# EAGLE design unimodule (EAGLE 9.6.0)
BOARD_REV: 1a

## Sheet 1 of 4
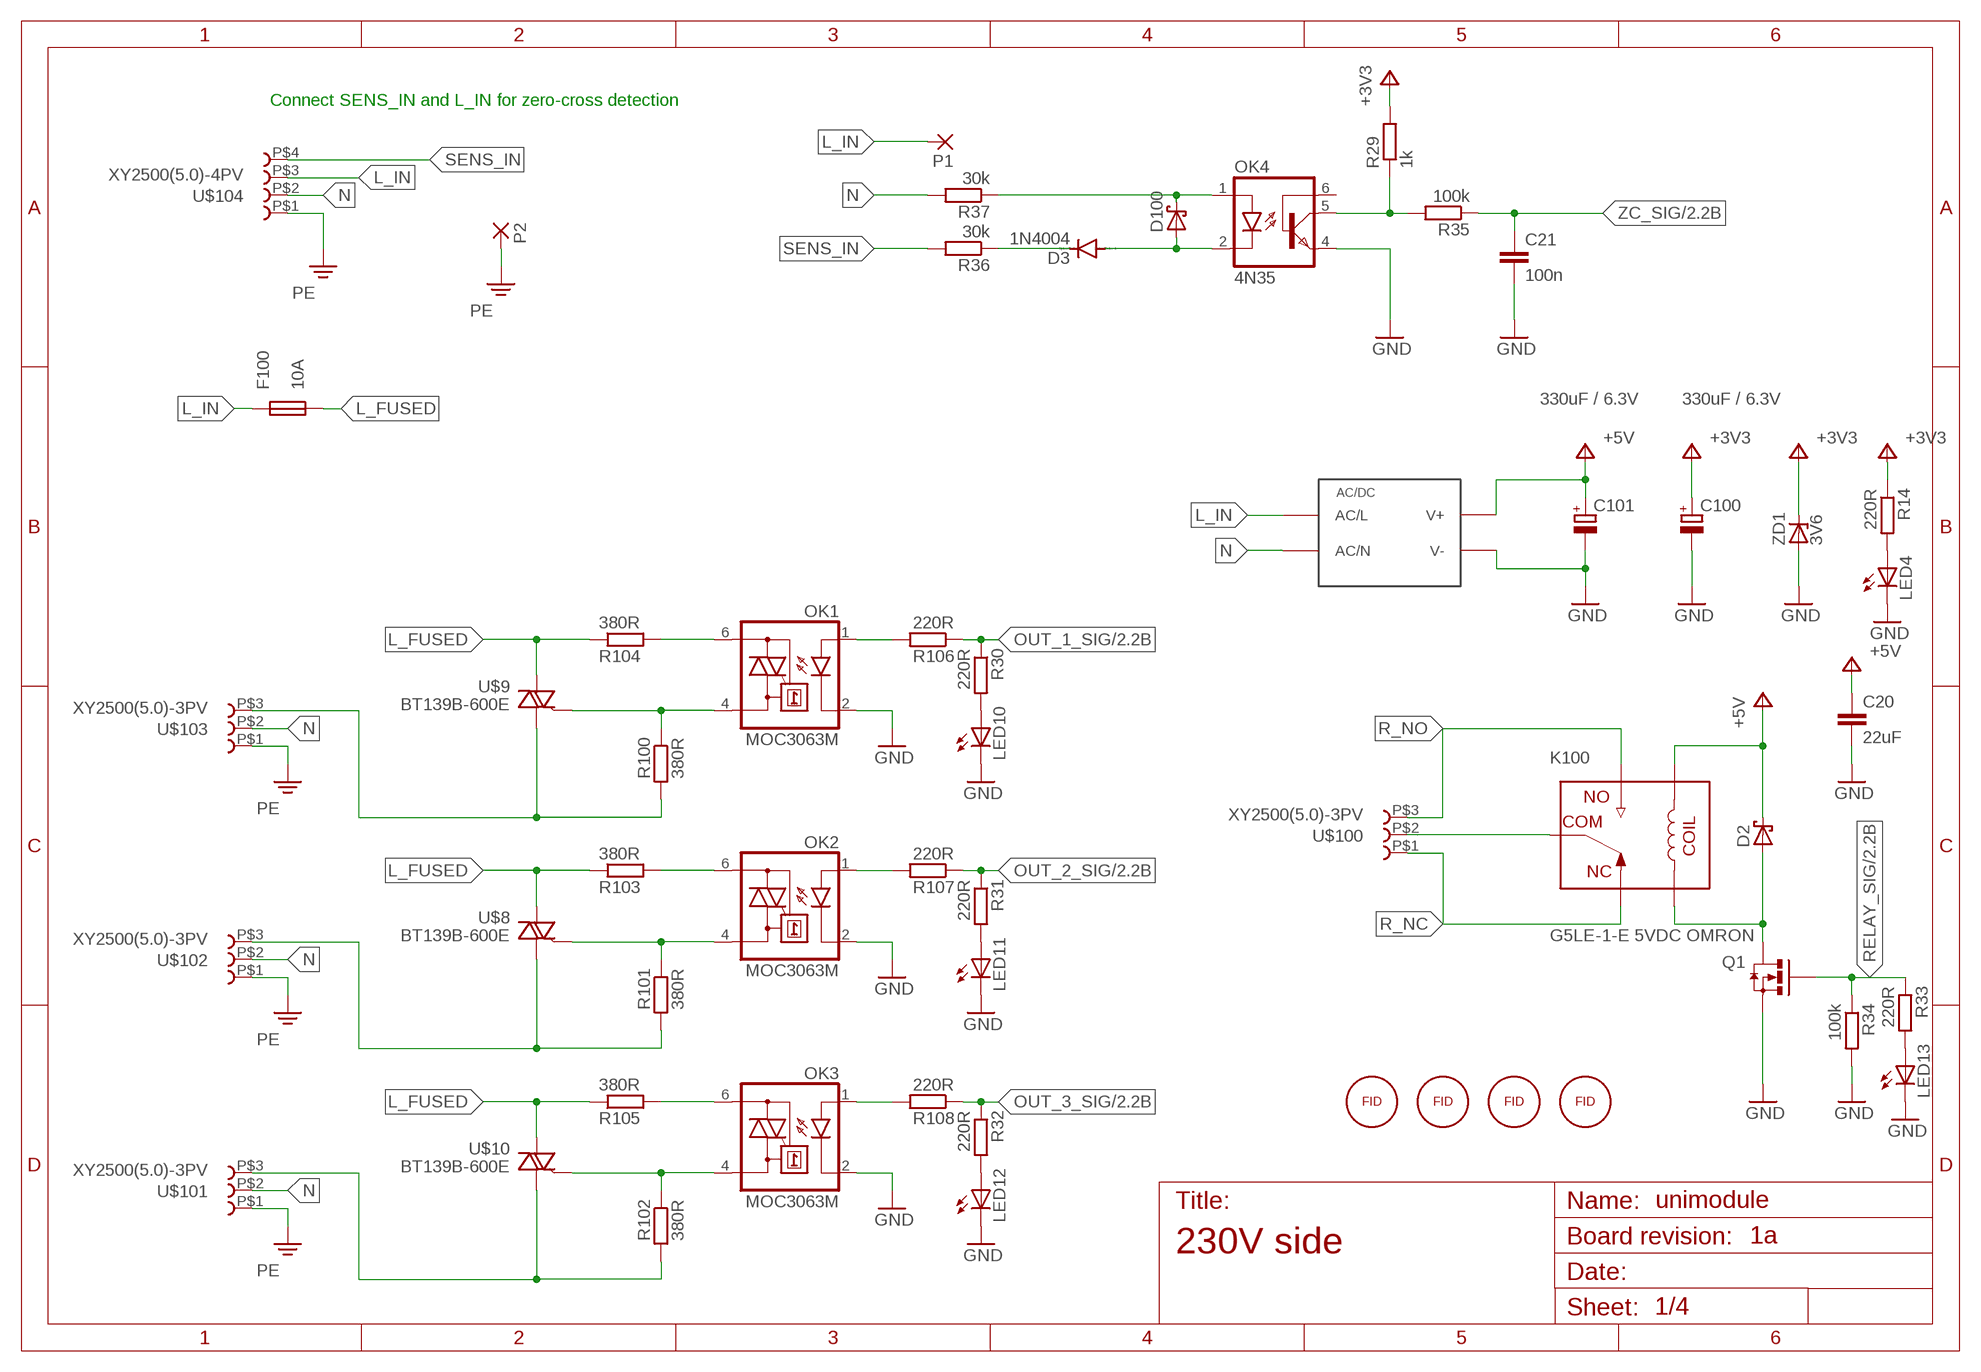
[diagram p0: schematic, sheet 1]
FRAME1 (A4L-LOC): TITLE: 230V side

### Parts
C20  22uF  C-EUC1206  [C1206]
C21  100n  C-EUC0603  [C0603]
C100  330uF / 6.3V  CPOL-EUE2.5-7  [E2,5-7]
C101  330uF / 6.3V  CPOL-EUE2.5-6  [E2,5-6]
D2  PMEG4005EH  [SOD123F]
D3  1N4004  [DO41-10]
D100  BAT46  [SOD123F]
F100  10A  FUSE20X5  [SCHURTER_0751.0056_5X20]
FD1  FIDUCIAL-MARKER2MM  [1-2MM-FIDUCIAL]
FD2  FIDUCIAL-MARKER2MM  [1-2MM-FIDUCIAL]
FD100  FIDUCIAL-MARKER2MM  [1-2MM-FIDUCIAL]
FD101  FIDUCIAL-MARKER2MM  [1-2MM-FIDUCIAL]
K100  G5LE-1-E 5VDC OMRON  JSM1-12V-5  [JSM1-12V-5]
LED4  LED0603  [LED-0603]
LED10  LED0603  [LED-0603]
LED11  LED0603  [LED-0603]
LED12  LED0603  [LED-0603]
LED13  LED0603  [LED-0603]
OK1  MOC3063M  MOC30  [DIL06]
OK2  MOC3063M  MOC30  [DIL06]
OK3  MOC3063M  MOC30  [DIL06]
OK4  4N35  [DIL06]
P1  WIRE-PAD1MM  [THT-PAD_0.5MM]
P2  WIRE-PAD3MM  [6MM2]
Q1  2N7002  [PG-SOT23]
R14  220R  R-EU_R0603  [R0603]
R29  1k  R-EU_R0603  [R0603]
R30  220R  R-EU_R0603  [R0603]
R31  220R  R-EU_R0603  [R0603]
R32  220R  R-EU_R0603  [R0603]
R33  220R  R-EU_R0603  [R0603]
R34  100k  R-EU_R0603  [R0603]
R35  100k  R-EU_R0603  [R0603]
R36  30k  R-EU_0207/10  [0207/10]
R37  30k  R-EU_0207/10  [0207/10]
R100  380R  R-EU_R1206  [R1206]
R101  380R  R-EU_R1206  [R1206]
R102  380R  R-EU_R1206  [R1206]
R103  380R  R-EU_R1206  [R1206]
R104  380R  R-EU_R1206  [R1206]
R105  380R  R-EU_R1206  [R1206]
R106  220R  R-EU_R0603  [R0603]
R107  220R  R-EU_R0603  [R0603]
R108  220R  R-EU_R0603  [R0603]
U$8  BT139B-600E  BT139B  [D2PACK]
U$9  BT139B-600E  BT139B  [D2PACK]
U$10  BT139B-600E  BT139B  [D2PACK]
U$100  XY2500(5.0)-3PV  [XY2500V-B_3P]
U$101  XY2500(5.0)-3PV  [XY2500V-B_3P]
U$102  XY2500(5.0)-3PV  [XY2500V-B_3P]
U$103  XY2500(5.0)-3PV  [XY2500V-B_3P]
U$104  XY2500(5.0)-4PV  [XY2500V-B_4P]
U$105  IRM-03-05  IRM-03  [IRM-03]
ZD1  3V6  BZD27SOD323-W  [SOD323-W]

### Nets
+3V3: C100.+ R14.1 R29.2 ZD1.C ; also sheet 2,3,4
+5V: C20.1 C101.+ D2.C K100.2 U$105.V+ ; also sheet 2,4
GND: C20.2 C21.2 C100.- C101.- LED4.C LED10.C LED11.C LED12.C LED13.C OK1.2(C) OK2.2(C) OK3.2(C) OK4.4(EMI) Q1.2(S) R34.2 U$105.V- ZD1.A ; also sheet 2,3,4
L_FUSED [HV]: F100.I_1 F100.I_2 F100.I_3 R103.1 R104.1 R105.1 U$8.2(A2) U$9.2(A2) U$10.2(A2)
L_IN [HV]: F100.O_1 F100.O_2 F100.O_3 P1.P$1(P) U$104.P$3 U$105.AC/L
L_OUT_1 [HV]: R100.2 U$9.1(A1) U$103.P$3
L_OUT_2 [HV]: R101.2 U$8.1(A1) U$102.P$3
L_OUT_3 [HV]: R102.2 U$10.1(A1) U$101.P$3
N [HV]: R37.2 U$101.P$2 U$102.P$2 U$103.P$2 U$104.P$2 U$105.AC/N
N$1 [HV]: D3.A D100.A OK4.2(C)
N$2 [HV]: D3.C R36.1
N$4 [HV]: D100.C OK4.1(A) R37.1
N$5 [HV]: OK3.6(A2) R105.2
N$6 [HV]: OK3.4(A1) R102.1 U$10.3(G)
N$7 [HV]: OK2.6(A2) R103.2
N$8: OK3.1(A) R108.2
N$9 [HV]: OK2.4(A1) R101.1 U$8.3(G)
N$10: OK2.1(A) R107.2
N$11 [HV]: OK1.6(A2) R104.2
N$12 [HV]: OK1.4(A1) R100.1 U$9.3(G)
N$13: OK1.1(A) R106.2
N$16: LED10.A R30.2
N$17: LED11.A R31.2
N$18: LED12.A R32.2
N$20: D2.A K100.5 Q1.3(D)
N$21: LED13.A R33.2
N$22: LED4.A R14.2
OUT_1_SIG: R30.1 R106.1 ; also sheet 2
OUT_2_SIG: R31.1 R107.1 ; also sheet 2
OUT_3_SIG: R32.1 R108.1 ; also sheet 2
PE [HV]: P2.P$1(P) P2.P$2(P) P2.P$5(P) P2.P$6(P) P2.P$7(P) P2.P$8(P) P2.P$9(P) P2.P$10(P) P2.P$11(P) U$101.P$1 U$102.P$1 U$103.P$1 U$104.P$1
R_C [HV]: K100.1 U$100.P$2
R_NC: K100.4 U$100.P$1
R_NO [HV]: K100.3 U$100.P$3
RELAY_SIG: Q1.1(G) R33.1 R34.1 ; also sheet 2
SENS_IN [HV]: R36.2 U$104.P$4
ZC: OK4.5(COL) R29.1 R35.2
ZC_SIG: C21.1 R35.1 ; also sheet 2
Unconnected: OK4.6(BAS)

### Notes on the sheet
- Connect SENS_IN and L_IN for zero-cross detection

## Sheet 2 of 4
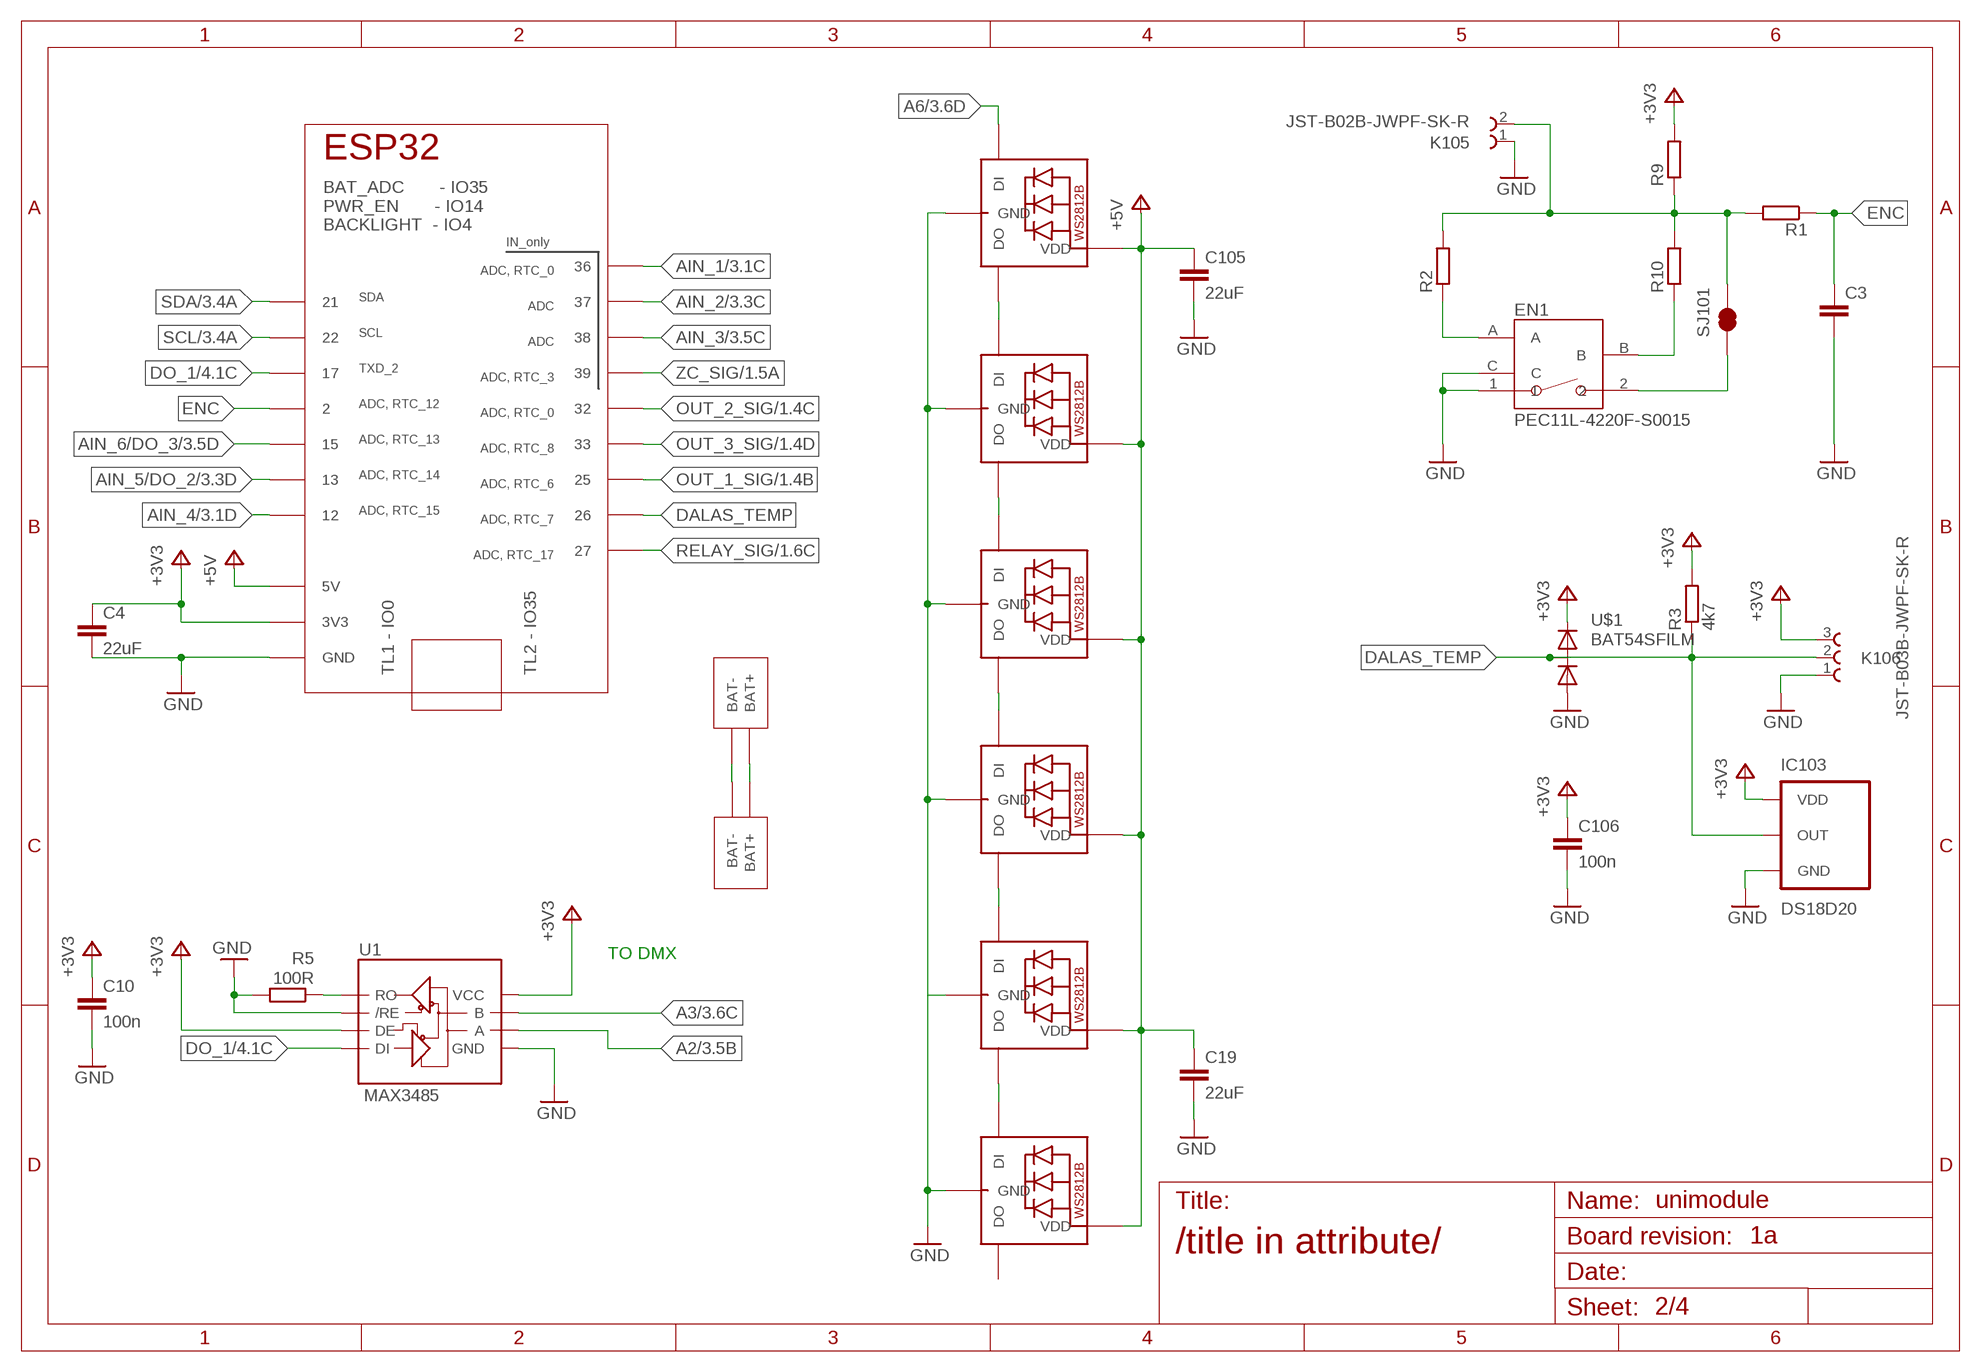
[diagram p1: schematic, sheet 2]
FRAME2 (A4L-LOC): TITLE: /title in attribute/

### Parts
C3  C-EUC0603  [C0603]
C4  22uF  C-EUC1206  [C1206]
C10  100n  C-EUC0603  [C0603]
C11  DISP_BATSMD  [BAT_SMD]
C19  22uF  C-EUC1206  [C1206]
C105  22uF  C-EUC1206  [C1206]
C106  100n  C-EUC0603  [C0603]
C107  DISP_BAT2,54  [BAT_THT_254]
EN1  PEC11L-4220F-S0015  [PEC11L-4220F-S0015]
IC1  TTGO_DISP  [TTGO_DISP_DEFAULT]
IC103  DS18D20  [TO92]
K105  JST-B02B-JWPF-SK-R  [JST-B02B-JWPF-SK-R]
K106  JST-B03B-JWPF-SK-R  [JST-B03B-JWPF-SK-R]
LED1  WS2812B5050  [WS2812B]
LED2  WS2812B5050  [WS2812B]
LED3  WS2812B5050  [WS2812B]
LED5  WS2812B5050  [WS2812B]
LED6  WS2812B5050  [WS2812B]
LED14  WS2812B5050  [WS2812B]
R1  R-EU_R0603  [R0603]
R2  R-EU_R0603  [R0603]
R3  4k7  R-EU_R0603  [R0603]
R5  100R  R-EU_R0603  [R0603]
R9  R-EU_R0603  [R0603]
R10  R-EU_R0603  [R0603]
SJ101  NET-TIE  [SMD-JUMPER-TIE]
U1  MAX3485  RS485SOIC  [SO08]
U$1  BAT54SFILM  [PG-SOT23]

### Nets
+3V3: C4.1 C10.1 C106.1 IC1.3V3_1(3V3) IC1.3V3_2(3V3) IC103.3(VDD) K106.3 R3.2 R9.2 U1.3(DE) U1.8(VCC) U$1.2(C) ; also sheet 1,3,4
+5V: C19.1 C105.1 IC1.5V LED1.1-VDD(VDD) LED2.1-VDD(VDD) LED3.1-VDD(VDD) LED5.1-VDD(VDD) LED6.1-VDD(VDD) LED14.1-VDD(VDD) ; also sheet 1,4
A2: U1.6(A) ; also sheet 3
A3: U1.7(B) ; also sheet 3
A6: LED1.4-DIN(DI) ; also sheet 3
AIN_1: IC1.36 ; also sheet 3
AIN_2: IC1.37 ; also sheet 3
AIN_3: IC1.38 ; also sheet 3
AIN_4: IC1.12 ; also sheet 3
AIN_5/DO_2: IC1.13 ; also sheet 3,4
AIN_6/DO_3: IC1.15 ; also sheet 3,4
BAT+: C11.BAT+ C107.BAT+
BAT-: C11.BAT- C107.BAT-
DALAS_TEMP: IC1.26 IC103.2(OUT) K106.2 R3.1 U$1.3(COMMON)
DO_1: IC1.17 U1.4(DI) ; also sheet 4
ENC: C3.1 IC1.2 R1.1
ENC_2: K105.2 R1.2 R2.2 R9.1 R10.2 SJ101.2
GND: C3.2 C4.2 C10.2 C19.2 C105.2 C106.2 EN1.1 EN1.C IC1.GND_1(GND) IC1.GND_2(GND) IC1.GND_3(GND) IC1.GND_4(GND) IC1.GND_5(GND) IC103.1(GND) K105.1 K106.1 LED1.3-GND(GND) LED2.3-GND(GND) LED3.3-GND(GND) LED5.3-GND(GND) LED6.3-GND(GND) LED14.3-GND(GND) R5.2 U1.2(/RE) U1.5(GND) U$1.1(A) ; also sheet 1,3,4
N$3: EN1.A R2.1
N$14: EN1.B R10.1
N$15: EN1.2 SJ101.1
N$19: LED1.2-DOUT(DO) LED2.4-DIN(DI)
N$25: LED2.2-DOUT(DO) LED3.4-DIN(DI)
N$26: LED3.2-DOUT(DO) LED5.4-DIN(DI)
N$27: LED5.2-DOUT(DO) LED6.4-DIN(DI)
N$28: LED6.2-DOUT(DO) LED14.4-DIN(DI)
N$38: R5.1 U1.1(RO)
OUT_1_SIG: IC1.25 ; also sheet 1
OUT_2_SIG: IC1.32 ; also sheet 1
OUT_3_SIG: IC1.33 ; also sheet 1
RELAY_SIG: IC1.27 ; also sheet 1
SCL: IC1.22 ; also sheet 3
SDA: IC1.21 ; also sheet 3
ZC_SIG: IC1.39 ; also sheet 1
Unconnected: LED14.2-DOUT(DO)

### Notes on the sheet
- TO DMX

## Sheet 3 of 4
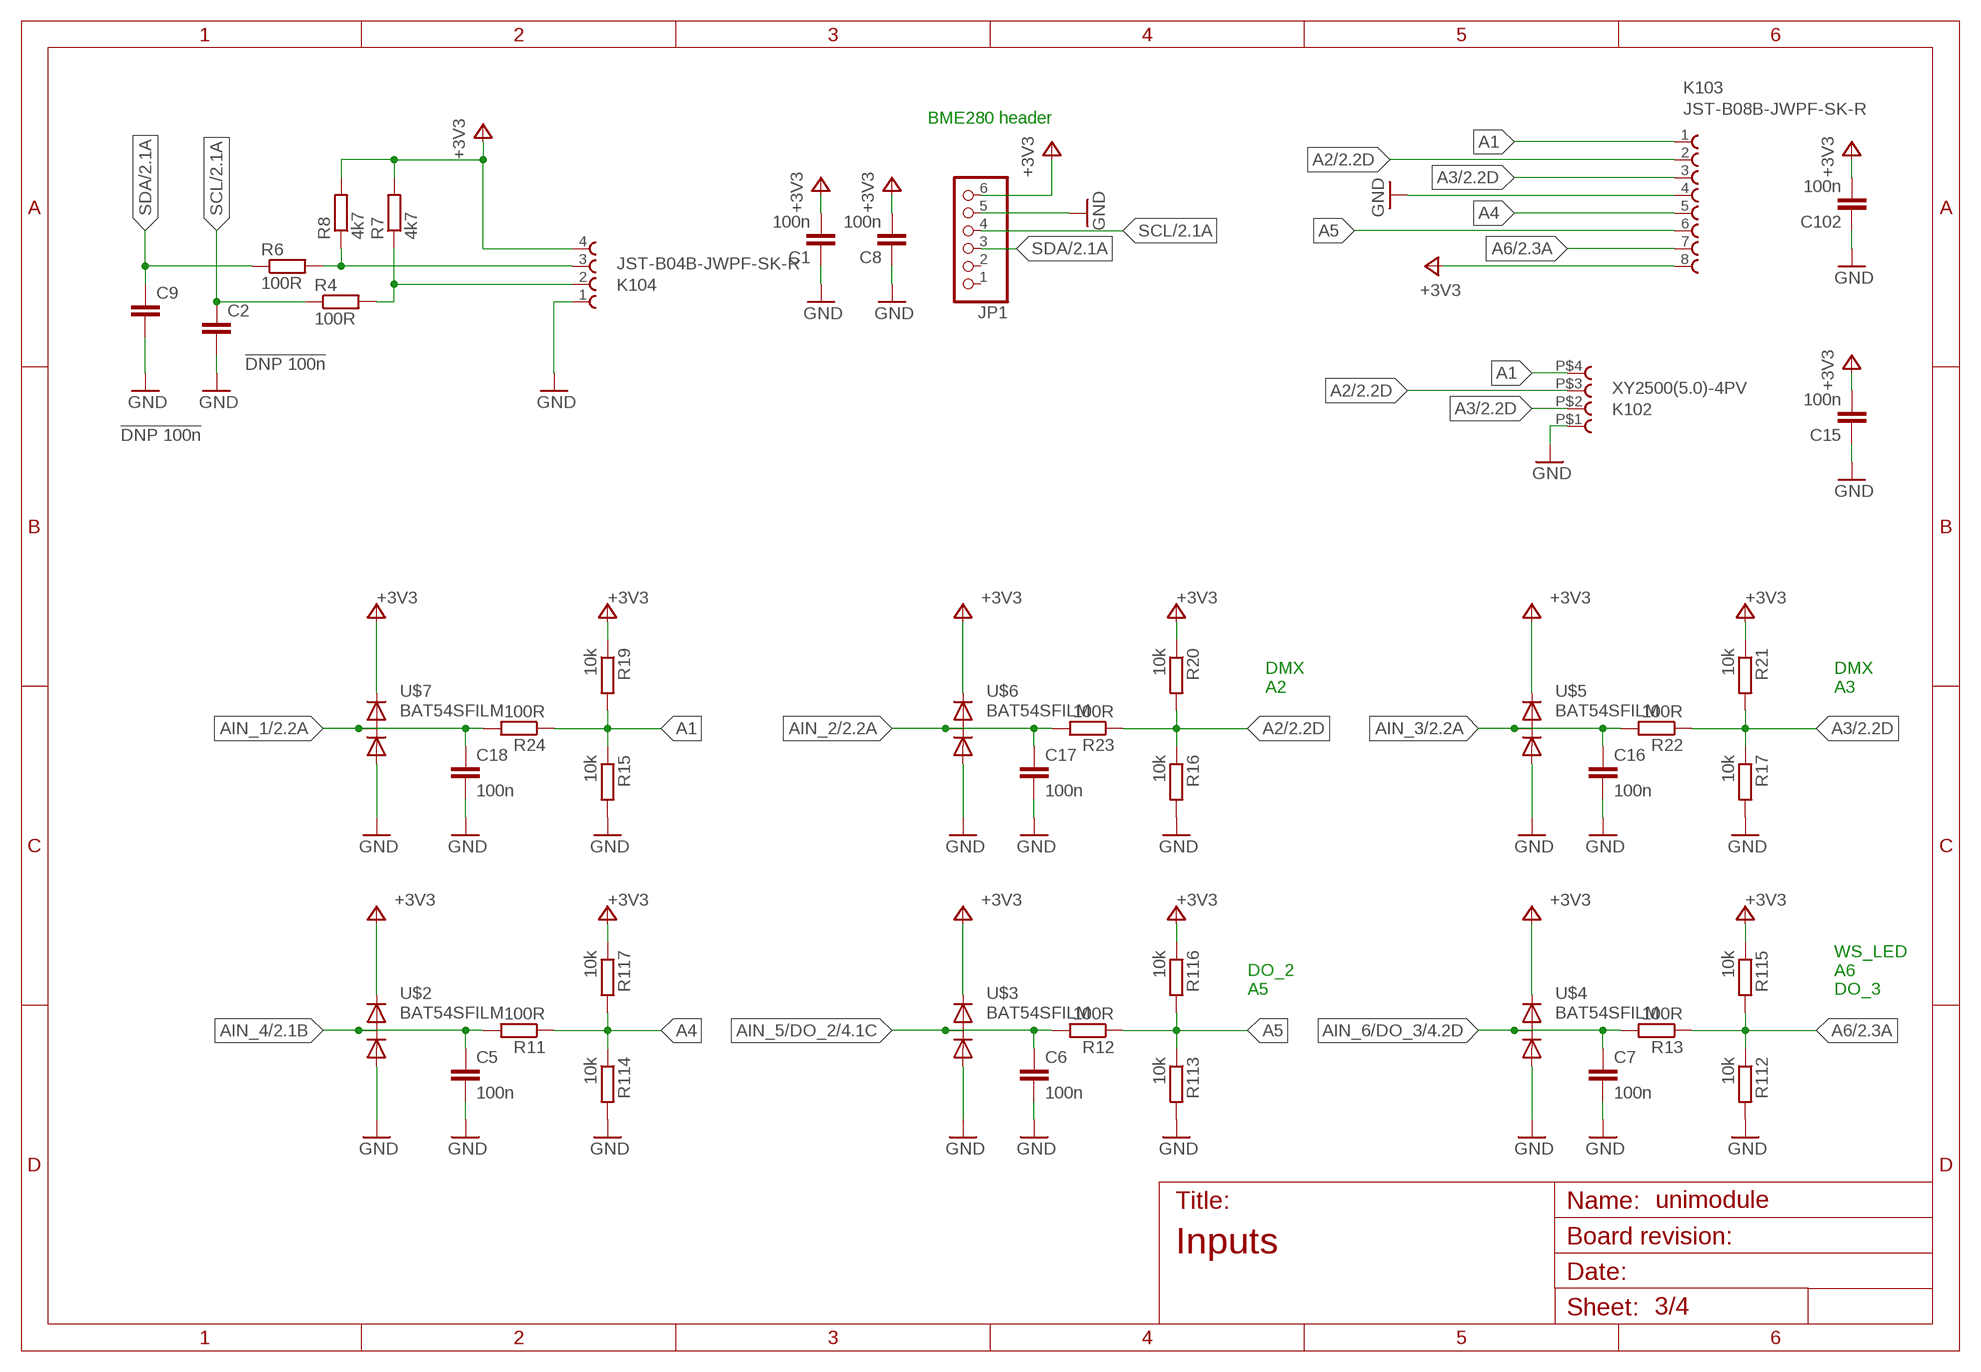
[diagram p2: schematic, sheet 3]
FRAME3 (A4L-LOC): TITLE: Inputs

### Parts
C1  100n  C-EUC0603  [C0603]
C2  !DNP 100n  C-EUC0603  [C0603]
C5  100n  C-EUC0603  [C0603]
C6  100n  C-EUC0603  [C0603]
C7  100n  C-EUC0603  [C0603]
C8  100n  C-EUC0603  [C0603]
C9  !DNP 100n  C-EUC0603  [C0603]
C15  100n  C-EUC0603  [C0603]
C16  100n  C-EUC0603  [C0603]
C17  100n  C-EUC0603  [C0603]
C18  100n  C-EUC0603  [C0603]
C102  100n  C-EUC0603  [C0603]
JP1  PINHD-1X6  [1X06]
K102  XY2500(5.0)-4PV  [XY2500V-B_4P]
K103  JST-B08B-JWPF-SK-R  [JST-B08B-JWPF-SK-R]
K104  JST-B04B-JWPF-SK-R  [JST-B04B-JWPF-SK-R]
R4  100R  R-EU_R0603  [R0603]
R6  100R  R-EU_R0603  [R0603]
R7  4k7  R-EU_R0603  [R0603]
R8  4k7  R-EU_R0603  [R0603]
R11  100R  R-EU_R0603  [R0603]
R12  100R  R-EU_R0603  [R0603]
R13  100R  R-EU_R0603  [R0603]
R15  10k  R-EU_R0603  [R0603]
R16  10k  R-EU_R0603  [R0603]
R17  10k  R-EU_R0603  [R0603]
R19  10k  R-EU_R0603  [R0603]
R20  10k  R-EU_R0603  [R0603]
R21  10k  R-EU_R0603  [R0603]
R22  100R  R-EU_R0603  [R0603]
R23  100R  R-EU_R0603  [R0603]
R24  100R  R-EU_R0603  [R0603]
R112  10k  R-EU_R0603  [R0603]
R113  10k  R-EU_R0603  [R0603]
R114  10k  R-EU_R0603  [R0603]
R115  10k  R-EU_R0603  [R0603]
R116  10k  R-EU_R0603  [R0603]
R117  10k  R-EU_R0603  [R0603]
U$2  BAT54SFILM  [PG-SOT23]
U$3  BAT54SFILM  [PG-SOT23]
U$4  BAT54SFILM  [PG-SOT23]
U$5  BAT54SFILM  [PG-SOT23]
U$6  BAT54SFILM  [PG-SOT23]
U$7  BAT54SFILM  [PG-SOT23]

### Nets
+3V3: C1.2 C8.2 C15.2 C102.2 JP1.6 K103.8 K104.4 R7.2 R8.2 R19.1 R20.1 R21.1 R115.1 R116.1 R117.1 U$2.2(C) U$3.2(C) U$4.2(C) U$5.2(C) U$6.2(C) U$7.2(C) ; also sheet 1,2,4
A1: K102.P$4 K103.1 R15.1 R19.2 R24.1
A2: K102.P$3 K103.2 R16.1 R20.2 R23.1 ; also sheet 2
A3: K102.P$2 K103.3 R17.1 R21.2 R22.1 ; also sheet 2
A4: K103.5 R11.1 R114.1 R117.2
A5: K103.6 R12.1 R113.1 R116.2
A6: K103.7 R13.1 R112.1 R115.2 ; also sheet 2
AIN_1: C18.1 R24.2 U$7.3(COMMON) ; also sheet 2
AIN_2: C17.1 R23.2 U$6.3(COMMON) ; also sheet 2
AIN_3: C16.1 R22.2 U$5.3(COMMON) ; also sheet 2
AIN_4: C5.1 R11.2 U$2.3(COMMON) ; also sheet 2
AIN_5/DO_2: C6.1 R12.2 U$3.3(COMMON) ; also sheet 2,4
AIN_6/DO_3: C7.1 R13.2 U$4.3(COMMON) ; also sheet 2,4
GND: C1.1 C2.2 C5.2 C6.2 C7.2 C8.1 C9.2 C15.1 C16.2 C17.2 C18.2 C102.1 JP1.5 K102.P$1 K103.4 K104.1 R15.2 R16.2 R17.2 R112.2 R113.2 R114.2 U$2.1(A) U$3.1(A) U$4.1(A) U$5.1(A) U$6.1(A) U$7.1(A) ; also sheet 1,2,4
SCL: C2.1 JP1.4 R4.1 ; also sheet 2
SCL_P: K104.2 R4.2 R7.1
SDA: C9.1 JP1.3 R6.1 ; also sheet 2
SDA_P: K104.3 R6.2 R8.1
Unconnected: JP1.1 JP1.2

### Notes on the sheet
- BME280 header
- DMX
  A2
- DMX
  A3
- DO_2
  A5
- WS_LED
  A6
  DO_3

## Sheet 4 of 4
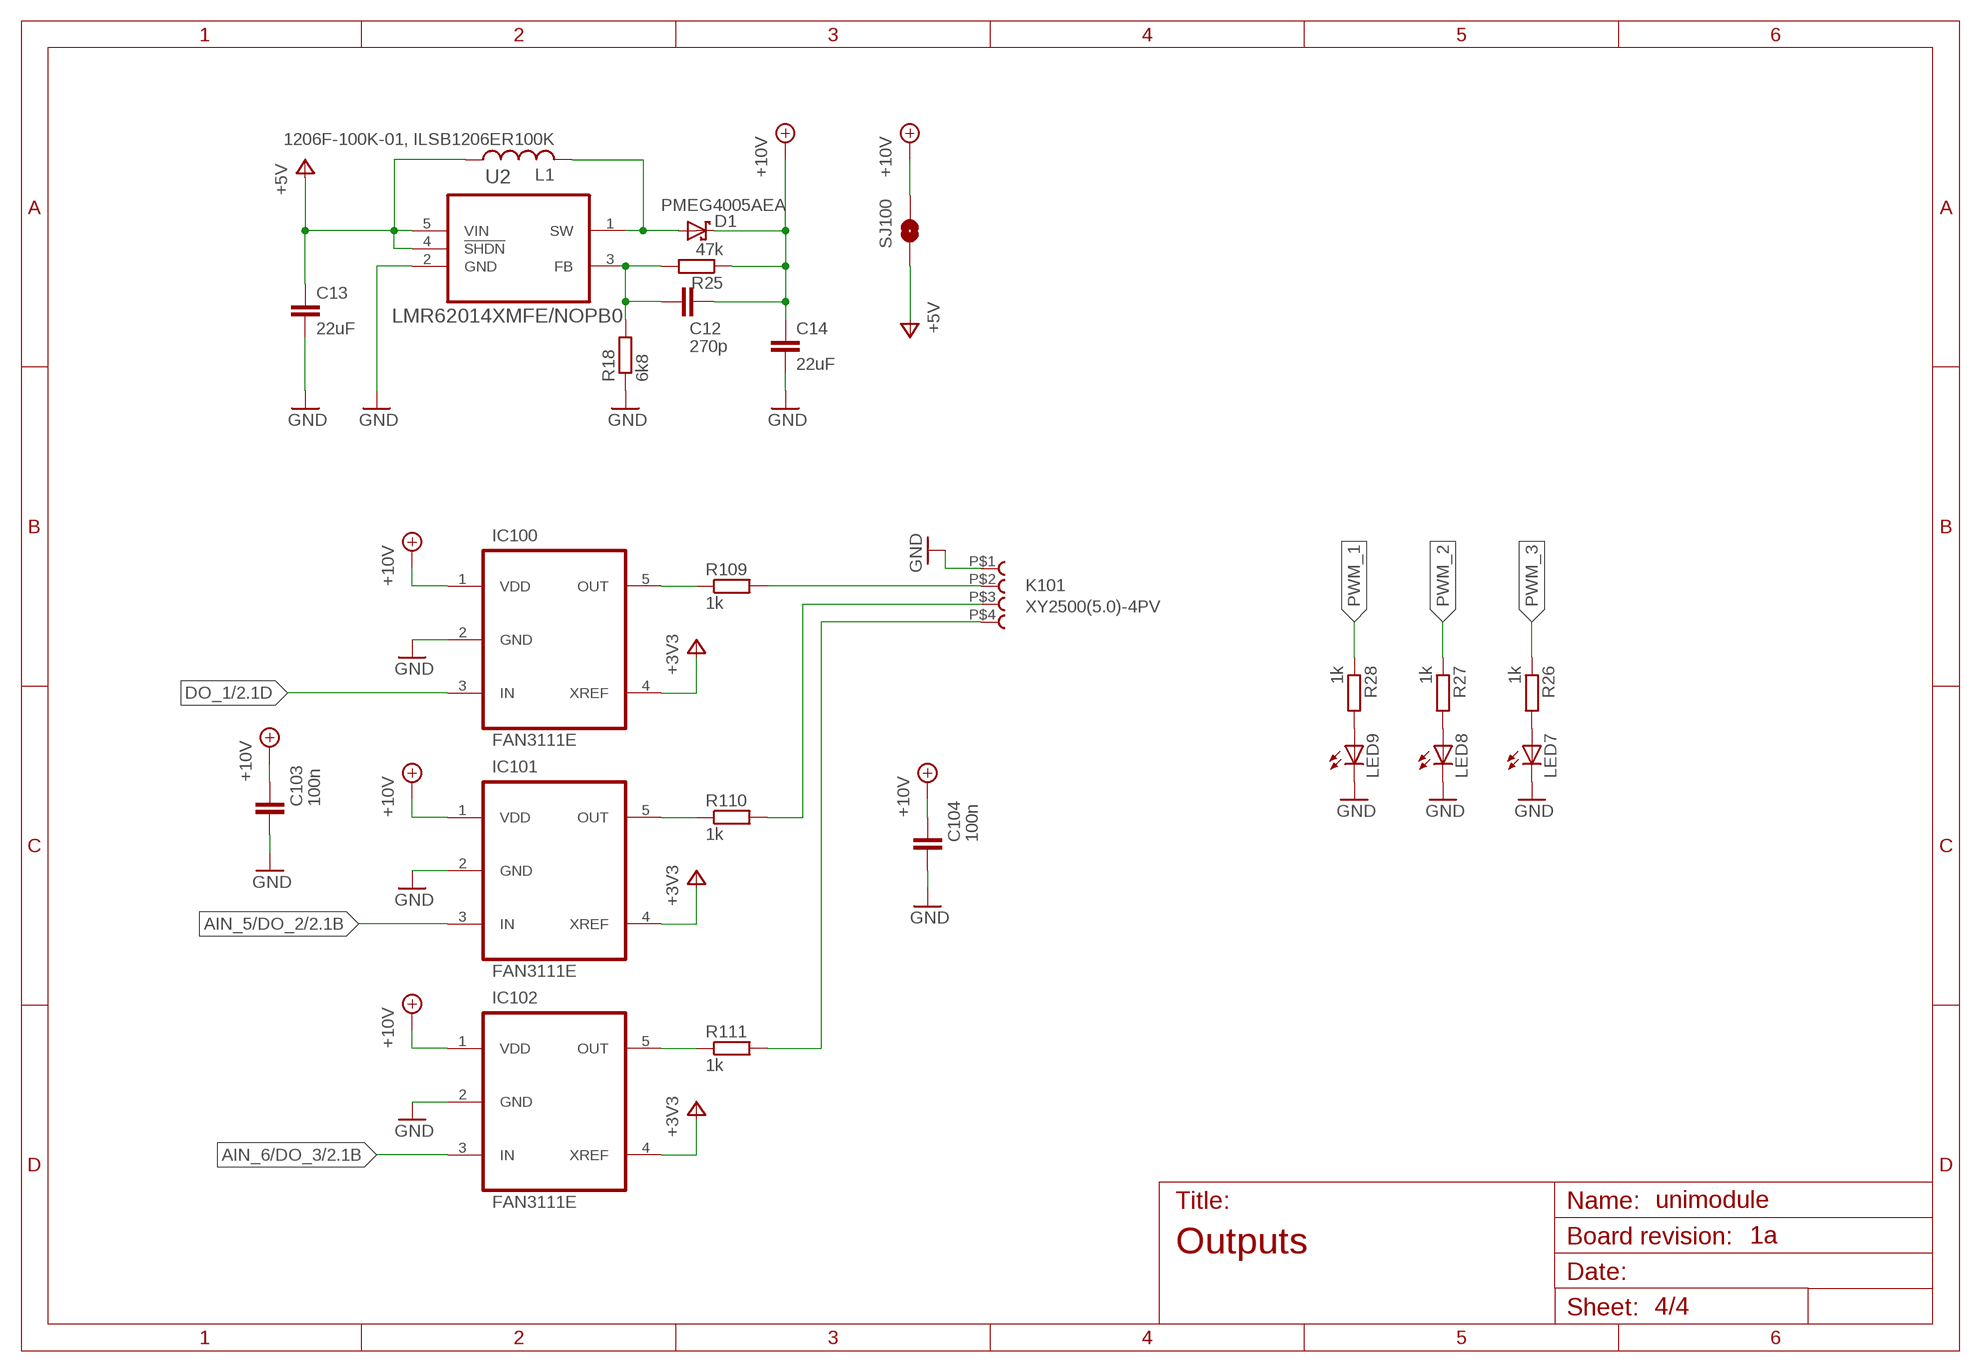
[diagram p3: schematic, sheet 4]
FRAME4 (A4L-LOC): TITLE: Outputs

### Parts
C12  270p  C-EUC0603  [C0603]
C13  22uF  C-EUC1206  [C1206]
C14  22uF  C-EUC1206  [C1206]
C103  100n  C-EUC0603  [C0603]
C104  100n  C-EUC0603  [C0603]
D1  PMEG4005AEA  PMEG4005EH  [SOD123F]
IC100  FAN3111E  [SOT23-5]
IC101  FAN3111E  [SOT23-5]
IC102  FAN3111E  [SOT23-5]
K101  XY2500(5.0)-4PV  [XY2500V-B_4P]
L1  1206F-100K-01, ILSB1206ER100K  L-US  [C3216]
LED7  LED0603  [LED-0603]
LED8  LED0603  [LED-0603]
LED9  LED0603  [LED-0603]
R18  6k8  R-EU_R0603  [R0603]
R25  47k  R-EU_R0603  [R0603]
R26  1k  R-EU_R0603  [R0603]
R27  1k  R-EU_R0603  [R0603]
R28  1k  R-EU_R0603  [R0603]
R109  1k  R-EU_R1206  [R1206]
R110  1k  R-EU_R1206  [R1206]
R111  1k  R-EU_R1206  [R1206]
SJ100  SMD-JUMPER  [SMD-JUMPER]
U2  LMR62014XMFE/NOPB0  [SOT23-5]

### Nets
+3V3: IC100.4(XREF) IC101.4(XREF) IC102.4(XREF) ; also sheet 1,2,3
+5V: C13.1 L1.1 SJ100.1 U2.4(!SHDN) U2.5(VIN) ; also sheet 1,2
+10V: C12.2 C14.1 C103.2 C104.2 D1.C IC100.1(VDD) IC101.1(VDD) IC102.1(VDD) R25.1 SJ100.2
AIN_5/DO_2: IC101.3(IN) ; also sheet 2,3
AIN_6/DO_3: IC102.3(IN) ; also sheet 2,3
DO_1: IC100.3(IN) ; also sheet 2
GND: C13.2 C14.2 C103.1 C104.1 IC100.2(GND) IC101.2(GND) IC102.2(GND) K101.P$1 LED7.C LED8.C LED9.C R18.1 U2.2(GND) ; also sheet 1,2,3
N$23: IC101.5(OUT) R110.1
N$24: D1.A L1.2 U2.1(SW)
N$29: LED9.A R28.2
N$30: LED8.A R27.2
N$31: IC100.5(OUT) R109.1
N$32: LED7.A R26.2
N$33: IC102.5(OUT) R111.1
N$34: C12.1 R18.2 R25.2 U2.3(FB)
PWM_1: K101.P$2 R28.1 R109.2
PWM_2: K101.P$3 R27.1 R110.2
PWM_3: K101.P$4 R26.1 R111.2

## Library data of the parts
C1-C10 C12-C21 C102 C105 C106 = rcl:C-EU: CAPACITOR, European symbol; SPICEPREFIX: C
C11 C107 = TTGO_LCD_DISP:DISP_BAT
C100 C101 = rcl:CPOL-EU: POLARIZED CAPACITOR, European symbol; SPICEPREFIX: C
C103 C104 = rcl:C-EU: CAPACITOR, European symbol
D1 D2 = siliXcon-semiconductors:PMEG4005; HEIGHT: 1.4
D3 = diode:1N4004: DIODE general purpose rectifier, 1 A
D100 = siliXcon-semiconductors:BAT46; HEIGHT: 1.4
EN1 = Encoders:PEC11L-4220F-S0015: ROTARY ENCODER MECHANICAL 15PPR Manufacturer's datasheet <https://www.bourns.com/docs/Product-Datasheets/PEC11L.pdf>; CREATED_BY: PCBLayout.com; DIGIKEY_PARTNO: PEC11L-4220F-S0015-ND; MANUFACTURER: Bourns Inc.; MPN: PEC11L-4220F-S0015
F100 = siliXcon-passive:FUSE; HEIGHT: 14
FD1 FD2 FD100 FD101 = siliXcon-pads:FIDUCIAL-MARKER; HEIGHT: 0.01
IC1 = TTGO_LCD_DISP:TTGO_DISP; HEIGHT: 11
IC100-IC102 = siliXcon-ICs:FAN3111E; HEIGHT: 1.4
IC103 = siliXcon-ICs:DS18D20; HEIGHT: 8
JP1 = pinhead:PINHD-1X6: PIN HEADER
K100 = Relay:JSM1-12V-5: RELAY AUTOMOTIVE SPDT 15A 12V Manufacturer's datasheet <https://media.digikey.com/pdf/Data%20Sheets/Panasonic%20Electric%20Works%20PDFs/JS-M_Series_Rev_Dec_2011.pdf>; CREATED_BY: PCBLayout.com; DIGIKEY_PARTNO: 255-1240-ND; MANUFACTURER: Panasonic Electric Works; MPN: JSM1-12V-5
K101 K102 U$104 = siliXcon-connectors:XY2500(5.0)-4P; HEIGHT: 12
K103 = siliXcon-connectors:JST-B08B-JWPF-SK-R; HEIGHT: 17
K104 = siliXcon-connectors:JST-B04B-JWPF-SK-R; HEIGHT: 17
K105 = siliXcon-connectors:JST-B02B-JWPF-SK-R; HEIGHT: 17
K106 = siliXcon-connectors:JST-B03B-JWPF-SK-R; HEIGHT: 17
L1 = rcl:L-US: INDUCTOR, American symbol
LED1-LED3 LED5 LED6 LED14 = adafruit:WS2812B
LED4 LED7-LED13 = siliXcon-semiconductors:LED; HEIGHT: 0.8
OK1-OK3 = siliXcon-ICs:MOC30: 6-Pin DIP Zero-Cross Optoisolators Triac Driver Output (250/400 Volt Peak); HEIGHT: 5
OK4 = optocoupler:4N35: MOTOROLA OPTO COUPLER; MF: FAIRCHILD SEMICONDUCTOR; MPN: 4N35; OC_FARNELL: 1328375; OC_NEWARK: 72K9946
P1 P2 = siliXcon-pads:WIRE-PAD
Q1 = siliXcon-semiconductors:2N7002; HEIGHT: 1.3
R1-R37 R100-R117 = rcl:R-EU_: RESISTOR, European symbol; SPICEPREFIX: R
SJ100 = siliXcon-pads:SMD-JUMPER; HEIGHT: 0.01
SJ101 = siliXcon-pads:NET-TIE; HEIGHT: 0.01
U1 = SparkFun-IC-Comms:RS485: RS-485 Transceiver SP3485 Series 8 Pin NSOIC 3.3 V Low Power Half Duplex RS-485 Transceiver MAX3485 compatible Datasheet <http://www.sparkfun.com/datasheets/Components/General/sp3485CN-LTR.pdf> SparkFun Products SparkFun Transceiver Breakout - RS-485 <https://www.sparkfun.com/products/10124> (BOB-10124) SparkFun USB to RS-485 Converter <https://www.sparkfun.com/products/9822> (BOB-09822); PROD_ID: IC-09388; VALUE: MAX3485CSA
U2 = siliXcon-ICs:LMR62014XMFE/NOPB: IC, SIMPLE SWITCHER 20Vout, 1.4A Step-Up Voltage Regulator in SOT-23-5; HEIGHT: 1.45
U$1-U$7 = siliXcon-semiconductors:BAT54SFILM: Shotkey diode - 40V 0,3A; HEIGHT: 1.5
U$8-U$10 = siliXcon-semiconductors:BT139B; HEIGHT: 5
U$100-U$103 = siliXcon-connectors:XY2500(5.0)-3P; HEIGHT: 12
U$105 = siliXcon-modules:IRM-; HEIGHT: 15
ZD1 = siliXcon-semiconductors:BZD27; HEIGHT: 1,2

## Net classes
1 HV: clearance 2 mm

## Board
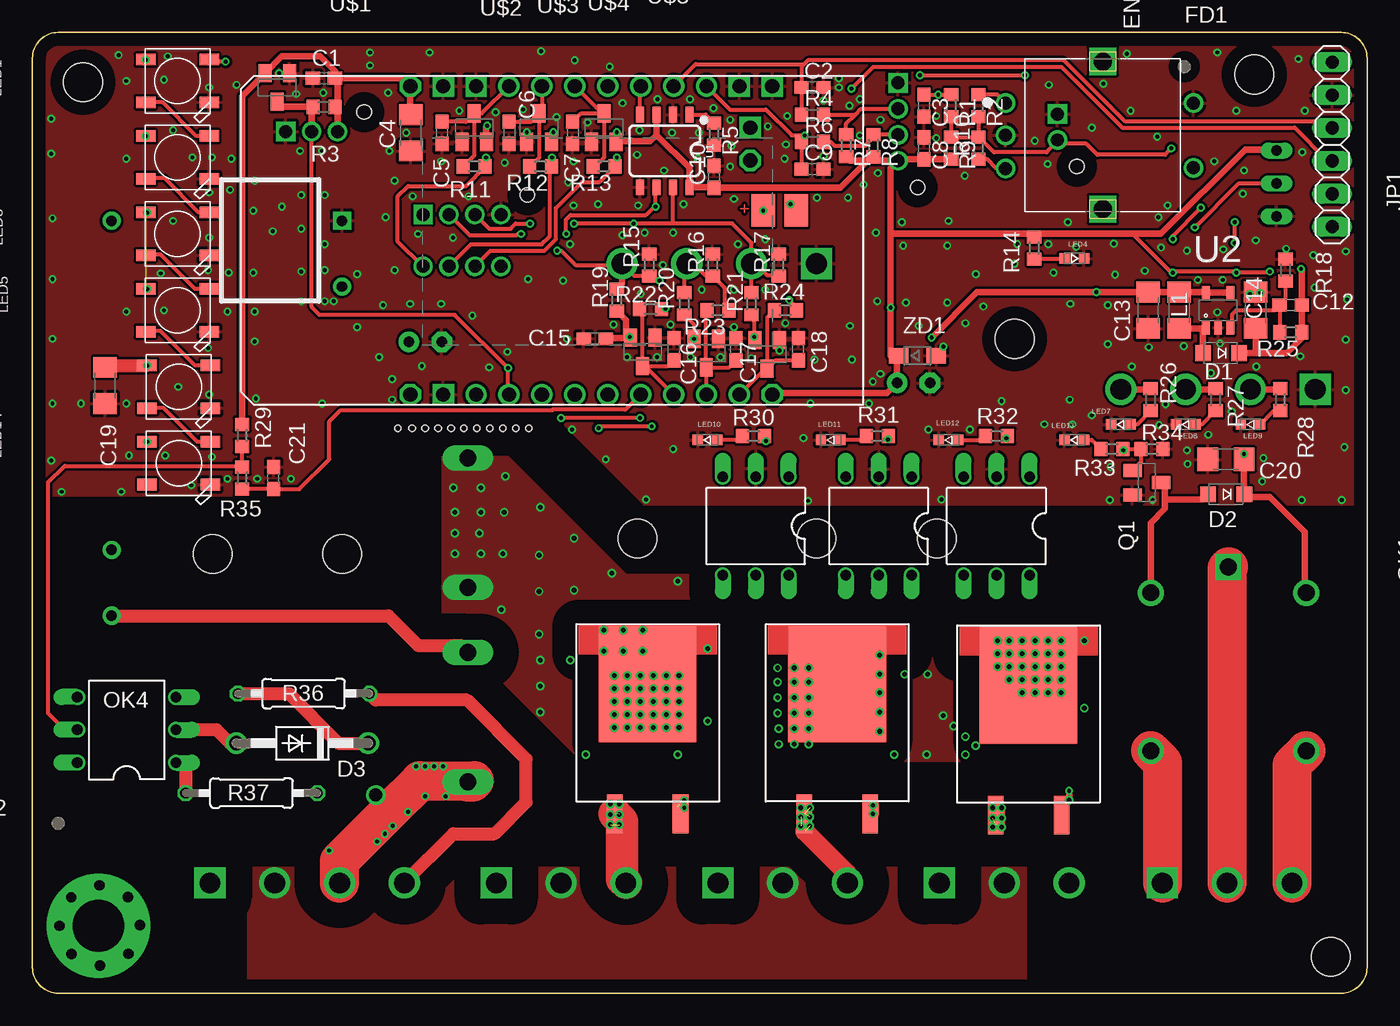
[diagram p4: board, top side]
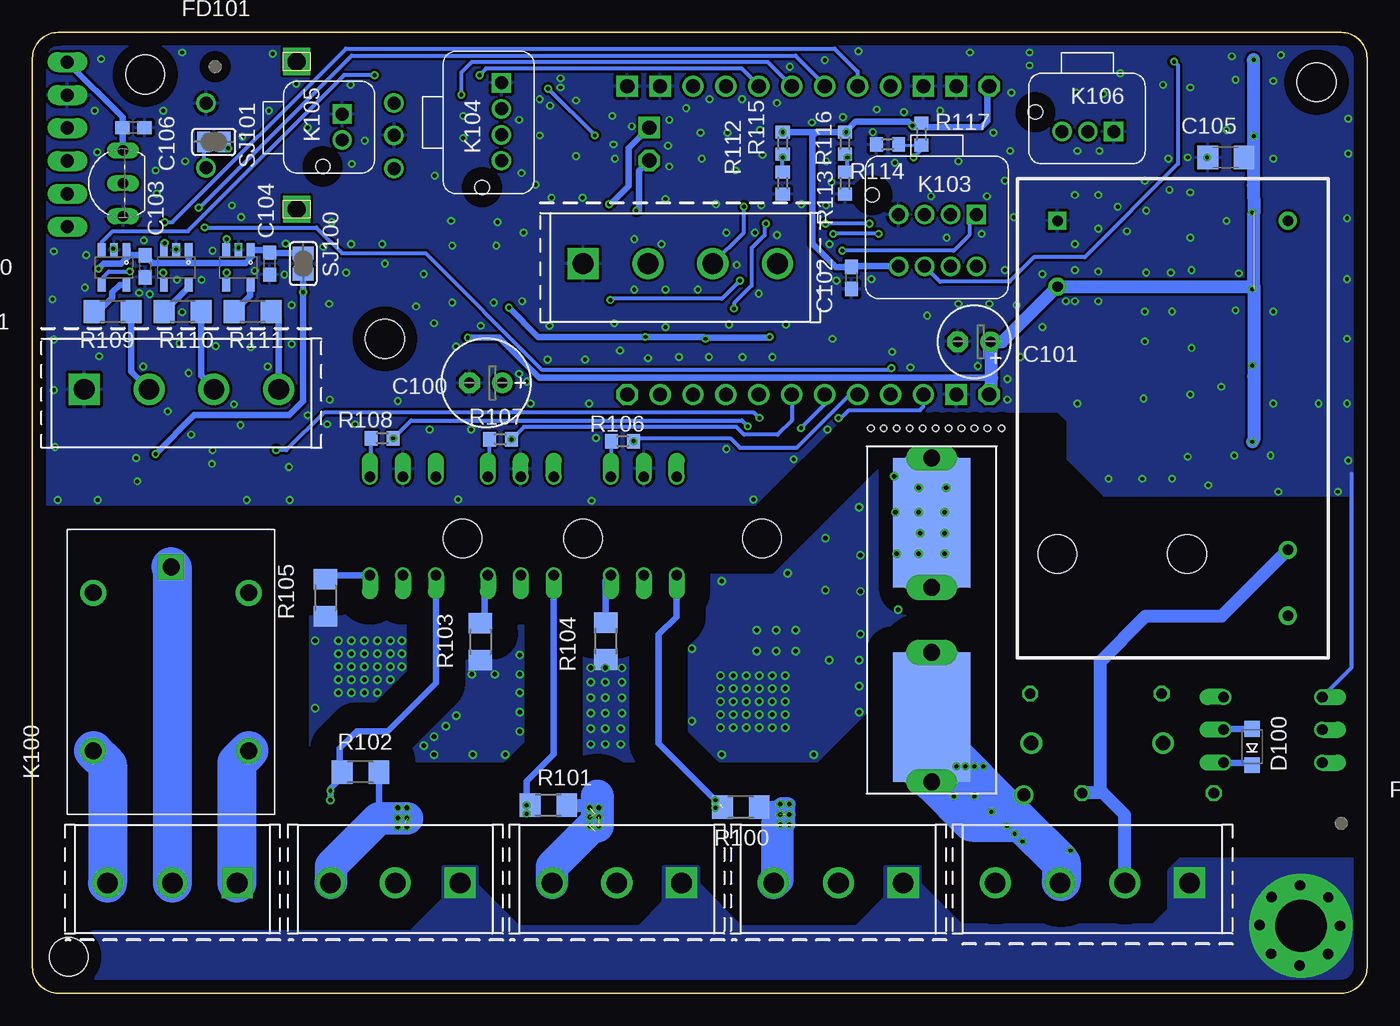
[diagram p5: board, bottom side, seen from below]

Size 103 x 74.15 mm. Coordinates in mm from the lower left corner, seen from the top.
Outline: 103,72.15 103,2 arc-90 101,0 2,0 arc-90 0,2 0,72.15 arc-90 2,74.15 101,74.15 arc-90 103,72.15
Copper layers (1*16): Top 0.035mm / dielectric 1.13mm / Bottom 0.035mm
Design rules "2layers-02mm": minimum track width 0.25mm, minimum drill 0.3mm, track to track 0.2mm, track to pad 0.2mm, pad to pad 0.2mm, via to via 0.2mm, smd to smd 0mil, copper to edge 1mm, drill to drill 0.3mm, minimum pad ring 0.15mm, minimum via ring 0.15mm, stop-mask expansion 0.05mm, vias tented up to drill 2.5mm, thermal gap 10mil
Holes 3 mm at 3.9,70.3 75.8,50.5 94.3,70.9 23.9,33.9 13.9,33.9 100.2,2.8 46.7,35.1 60.5,35.1 69.8,35.1
Holes 0.5 mm at 29.3,43.6 28.2,43.6 30.3,43.6 31.3,43.6 32.3,43.6 33.3,43.6 34.3,43.6 35.3,43.6 36.3,43.6 37.3,43.6 38.3,43.6

### Footprints (pad centres in the part's own frame; a part is rotated, then mirrored left to right if it is on the bottom)
C0603 = smd 1.1 x 1: 1 -0.85,0; 2 0.85,0
C1206 = smd 1.6 x 1.8: 1 -1.4,0; 2 1.4,0
BAT_SMD = smd 1.8 x 2.5: BAT+ 0,0; BAT- 2.54,0
E2,5-7 = drill 0.813 pad 1.6: + -1.27,0 | drill 0.813 pad 1.6 octagon: - 1.27,0
E2,5-6 = drill 0.813 pad 1.6: + -1.27,0 | drill 0.813 pad 1.6 octagon: - 1.27,0
BAT_THT_254 = drill 1.1 octagon: BAT+ 2.54,0 | drill 1.1 square: BAT- 0,0
SOD123F = smd 1.2 x 1.2: A 1.375,0; C -1.425,0
DO41-10 = drill 1.118: A 5.08,0; C -5.08,0
PEC11L-4220F-S0015 = drill 1: 1 -2.5,7; 2 2.5,7; A -2.5,-7.5; B 2.55,-7.5; C 0,-7.5 | drill 1.4 square: M1 -5.7,0; M2 5.7,0
SCHURTER_0751.0056_5X20 = drill 1.3 long: I_1 0,0; I_2 10,0; O_1 15,0; O_2 25,0 | smd 10 x 6: I_3 5,0; O_3 20,0
TTGO_DISP_DEFAULT = drill 1.1: 2 12.7,0; 12 20.32,0; 13 17.78,0; 15 15.24,0; 17 10.16,0; 21 5.08,0; 22 7.62,0; 25 17.78,23.8; 26 20.32,23.8; 27 22.86,23.8; 32 12.7,23.8; 33 15.24,23.8; 36 2.54,23.8; 37 5.08,23.8; 38 7.62,23.8; 39 10.16,23.8 | drill 1.1 octagon: 3V3_1 0,23.8; 3V3_2 27.94,0; 5V 27.94,23.8 | drill 1.1 square: GND_1 0,0; GND_2 2.54,0; GND_3 22.86,0; GND_4 25.4,0; GND_5 25.4,23.8
SOT23-5 = smd 0.6 x 1.05: 1 -0.95,-1.35; 2 0,-1.35; 3 0.95,-1.35; 4 0.95,1.35; 5 -0.95,1.35
TO92 = drill 0.813 long: 1 -2.54,0; 2 0,0; 3 2.54,0
1X06 = drill 1.016 long: 1 -6.35,0; 2 -3.81,0; 3 -1.27,0; 4 1.27,0; 5 3.81,0; 6 6.35,0
JSM1-12V-5 = drill 1.3 pad 2 square: 1 8.1,0 | drill 1.3 pad 2: 2 6.1,6; 3 -6.1,6; 4 -6.1,-6; 5 6.1,-6
XY2500V-B_4P = drill 1.6 square: P$1 0,0 | drill 1.6: P$2 5,0; P$3 10,0; P$4 15,0
JST-B08B-JWPF-SK-R = drill 1 square: 1 8.05,-1.5 | drill 1: 2 6.05,-1.5; 3 4.05,-1.5; 4 2.05,-1.5; 5 8.05,-5.5; 6 6.05,-5.5; 7 4.05,-5.5; 8 2.05,-5.5 | hole 1.1: 0,0
JST-B04B-JWPF-SK-R = drill 1 square: 1 8.05,-1.5 | drill 1: 2 6.05,-1.5; 3 4.05,-1.5; 4 2.05,-1.5 | hole 1.1: 0,0
JST-B02B-JWPF-SK-R = drill 1 square: 1 4.05,-1.5 | drill 1: 2 2.05,-1.5 | hole 1.1: 0,0
JST-B03B-JWPF-SK-R = drill 1 square: 1 6.05,-1.5 | drill 1: 2 4.05,-1.5; 3 2.05,-1.5 | hole 1.1: 0,0
C3216 = smd 1.6 x 1.8: 1 -1.4,0; 2 1.4,0
WS2812B = smd 1.5 x 0.9: 1-VDD 2.45,-1.65; 2-DOUT 2.45,1.65; 3-GND -2.45,1.65; 4-DIN -2.45,-1.65
LED-0603 = smd 0.8 x 0.8: A 0,-0.75; C 0,0.75
DIL06 = drill 0.813 offset: 1 -2.54,-3.81; 2 0,-3.81; 3 2.54,-3.81; 4 2.54,3.81; 5 0,3.81; 6 -2.54,3.81
THT-PAD_0.5MM = drill 1: P$1 0,0
6MM2 = drill 4 pad 8: P$1 0,0 | drill 0.8 pad 1: P$2 -3,0; P$5 -2.106,2.2; P$6 0.082,3.123; P$7 2.282,2.228; P$8 3.205,0.041; P$9 2.31,-2.159; P$10 0.123,-3.082; P$11 -2.077,-2.188
PG-SOT23 = smd 1 x 1.4: 1 -0.95,-1.1; 2 0.95,-1.1; 3 0,1.1
R0603 = smd 1 x 1.1: 1 -0.85,0; 2 0.85,0
0207/10 = drill 0.813 octagon: 1 -5.08,0; 2 5.08,0
R1206 = smd 1.6 x 1.803: 1 -1.422,0; 2 1.422,0
SMD-JUMPER = smd 1 x 1.6: 1 -0.8,0; 2 0.8,0
SMD-JUMPER-TIE = smd 1 x 1.6: 1 -0.8,0; 2 0.8,0
SO08 = smd 0.6 x 1.2: 1 -1.905,-2.8; 2 -0.635,-2.8; 3 0.635,-2.8; 4 1.905,-2.8; 5 1.905,2.8; 6 0.635,2.8; 7 -0.635,2.8; 8 -1.905,2.8
D2PACK = smd 1.2 x 3: 1 -2.54,-6.35; 3 2.54,-6.35 | smd 7.5 x 8.95: 2 0,3.68
XY2500V-B_3P = drill 1.6 square: P$1 0,0 | drill 1.6: P$2 5,0; P$3 10,0
IRM-03 = drill 0.8 pad 1.4: AC/L 30.48,17.78; AC/N 25.4,17.78; NC 0,17.78; V+ 5.08,0 | drill 0.8 pad 1.4 square: V- 0,0
SOD323-W = smd 1.5 x 1.2: A 1.45,0; C -1.45,0

### Placement (x,y rotation side)
C1  22.5,70.6 0 top
C2  60.2,69.9 0 top
C3  68.8,68.5 270 top
C4  29.2,66.4 270 top
C5  31.6,66.4 270 top
C6  36.8,66.4 270 top
C7  41.7,66.4 270 top
C8  68.8,65.2 270 top
C9  60.2,63.6 0 top
C10  52.6,63 90 top
C11  56.4,60.4 0 top
C12  97.1,53.1 0 top
C13  86.1,52.7 270 top
C14  94.4,52.7 90 top
C15  43.4,50.5 0 top
C16  49.5,49.7 90 top
C17  54.3,49.7 90 top
C18  59.1,49.7 90 top
C19  5.6,46.9 270 top
C20  92.1,41.2 180 top
C21  18.6,39.75 90 top
C100  68,47.1 180 bottom
C101  30.32,50.27 180 bottom
C102  39.8,55.2 90 bottom
C103  94.3,56.1 90 bottom
C104  84.7,56.3 90 bottom
C105  10.9,64.5 180 bottom
C106  95.2,66.8 0 bottom
C107  55.4,66.8 270 bottom
D1  91.7,49.4 180 top
D2  92.1,38.5 180 top
D3  20.83,19.29 180 top
D100  8.87,19.02 90 bottom
EN1  82.6,66.2 270 top
F100  33.6,41.3 270 bottom
FD1  88.9,71.5 0 top
FD2  2,13.1 0 top
FD100  2,13.1 0 bottom
FD101  88.9,71.5 0 bottom
IC1  57.1,70 180 top
IC100  96.7,56 180 bottom
IC101  91.9,56 180 bottom
IC102  87.1,56 180 bottom
IC103  96,62.5 90 bottom
JP1  100.3,65.5 90 top
K100  92.3,24.8 90 bottom
K101  99,46.6 0 bottom
K102  60.5,56.3 0 bottom
K103  38.2,61.6 0 bottom
K104  68.3,62.2 90 bottom
K105  80.6,63.8 90 bottom
K106  25.6,68 0 bottom
L1  88.5,52.7 270 top
LED1  11.2,70.4 180 top
LED2  11.2,64.5 180 top
LED3  11.2,58.6 180 top
LED4  80.4,56.7 270 top
LED5  11.2,52.7 180 top
LED6  11.3,46.8 180 top
LED7  84,43.9 90 top
LED8  89,43.9 90 top
LED9  94,43.9 90 top
LED10  52.1,42.7 90 top
LED11  61.6,42.7 90 top
LED12  70.7,42.7 90 top
LED13  80.4,42.7 90 top
LED14  11.3,40.9 180 top
OK1  55.82,36.06 180 top
OK2  65.31,36.05 180 top
OK3  74.4,36.05 180 top
OK4  7.27,20.32 90 top
P1  26.5,15.3 0 top
P2  5.1,5.2 0 top
Q1  86,39.4 270 top
R1  70.9,68.5 270 top
R2  73,68.5 270 top
R3  22.5,68.4 0 top
R4  60.2,67.8 0 top
R5  52.6,66.3 270 top
R6  60.2,65.7 0 top
R7  62.8,65.4 270 top
R8  64.9,65.4 270 top
R9  70.9,65.2 270 top
R10  73,65.2 90 top
R11  34.1,63.8 180 top
R12  39.2,63.8 180 top
R13  44.1,63.8 180 top
R14  77.3,57.5 270 top
R15  47.6,56.2 90 top
R16  52.5,56.2 90 top
R17  57.6,56.2 90 top
R18  96.7,55.8 270 top
R19  45.1,53.5 90 top
R20  50.3,53.2 90 top
R21  55.5,53.2 90 top
R22  47.7,52.8 180 top
R23  52.9,52.7 180 top
R24  58.1,52.7 180 top
R25  97.1,51 180 top
R26  86.3,45.8 270 top
R27  91.3,45.8 270 top
R28  96.3,45.8 270 top
R29  16.18,43.05 90 top
R30  55.65,43 180 top
R31  65.2,43 180 top
R32  74.4,43 180 top
R33  83.3,42 180 top
R34  86.4,42 0 top
R35  16.19,39.75 90 top
R36  20.93,23.12 0 top
R37  16.91,15.44 0 top
R100  48.33,14.36 0 bottom
R101  63.18,14.5 0 bottom
R102  77.68,17.06 0 bottom
R103  68.42,27.12 90 bottom
R104  58.76,27.18 90 bottom
R105  80.38,30.52 90 bottom
R106  57.45,42.6 180 bottom
R107  66.88,42.74 180 bottom
R108  76,42.82 180 bottom
R109  96.8,52.6 0 bottom
R110  91.4,52.6 0 bottom
R111  86,52.6 0 bottom
R112  45.1,62.5 270 bottom
R113  40.3,62.5 270 bottom
R114  37,65.5 180 bottom
R115  45.1,65.6 270 bottom
R116  40.3,65.6 270 bottom
R117  34.4,66.3 270 bottom
SJ100  82.1,56.3 90 bottom
SJ101  89,65.7 0 bottom
U1  48.8,65 180 top
U2  91.5,52.7 0 top
U$1  18.9,69.9 180 top
U$2  34.1,66.8 0 top
U$3  39.1,66.8 0 top
U$4  44.1,66.8 0 top
U$5  47.1,49.5 180 top
U$6  52,49.4 180 top
U$7  56.7,49.3 180 top
U$8  62.11,20.19 0 top
U$9  47.47,20.18 0 top
U$10  76.87,20.09 0 top
U$100  87.2,8.5 180 bottom
U$101  70,8.5 180 bottom
U$102  52.9,8.5 180 bottom
U$103  35.8,8.5 180 bottom
U$104  13.7,8.5 180 bottom
U$105  23.89,59.61 270 bottom
ZD1  68.3,49.2 0 top

### Tracks (layer width: path | path; a pad name or v marks a point on that pad's centre or on a via)
+3V3  (via drill 0.3 pad 0.6)
  Top 0.3: v95.5,55.7 95.4,55.6 v92.9,55.6 92.8,55.7 88.1,55.7 v88,55.6 87.9,55.6 84.9,58.6 | ZD1.C 66.43,49.2 | 66.73,48.7 66.43,49 66.23,49.2 | R20.1 51.05,51.6 U$6.2 | R21.1 55.7,52.15 55.7,50.45
  Top 0.5: K106.3 23.55,68.6 | 23.55,68.6 23.55,70.4 C1.2 | C1.2 28.56,70.6 IC1.3V3_2 29.16,67.84 C4.1 | IC1.3V3_1 57.2,46.3 65.93,46.3 C100.+ 66.73,48.7 | 48.16,66.23 U1.3 | 48.16,66.23 50.7,63.69 U1.8 52.55,62.2 C10.1 62.35,62.15 64.45,64.25 | 64.45,64.25 63.1,64.25 R7.2 | 64.45,64.25 64.9,64.25 | 64.9,64.25 K104.4 | 66.43,49 66.43,49.2 | 66.23,49.2 v66.23,52.9 66.23,58.6 | 66.23,58.6 66.23,63.68 K104.4 | K104.4 66.9,64.35 C8.2 R9.2 | R3.2 23.55,68.6 | C1.2 23.35,71.15 22.2,72.3 19.25,72.3 U$1.2 16.18,69.23 R29.2 | R8.2 64.9,64.25 | IC103.3 96.05,65.09 93.59,65.09 87.1,58.6 84.9,58.6 77.3,58.6 | 77.3,58.6 77.05,58.6 | 77.05,58.6 66.23,58.6 | U$3.2 40.05,66.3 v40.2,66.45 | U$2.2 35,65.75 35,66.85 v35.1,66.95 | U$7.2 55.7,50.45 v55.7,50.65 | C15.2 44.3,50.55 46.1,50.55 v46.1,50.65 U$5.2 45.8,50.95 45.8,51.95 R19.1 | U$4.2 45.1,65.75 | 45.1,65.75 R115.1 | 45.1,65.75 47.68,65.75 48.16,66.23 | 77.3,58.6 R14.1 77.05,58.6
  Bottom 0.25: v35.1,66.95 35.1,66.85
  Bottom 0.3: IC100.4 97.5,54.8 97.5,55.3 97.1,55.7 v95.5,55.7 | v92.9,55.6 92.9,54.7 IC101.4 | v88,55.6 88.05,55.55 IC102.4
  Bottom 0.5: JP1.6 96.05,67.6 C106.1 96.05,65.09 IC103.3 | IC1.3V3_2 29.3,69.86 29.3,67.3 29.75,66.85 34.1,66.85 R117.1 34.7,66.85 35.1,66.85 | R116.1 39.5,67.25 35.4,67.25 v35.1,66.95 | R116.1 42.5,66.45 | 42.5,66.45 R115.1 | K103.8 39.75,56.1 C102.2 41,56.05 42.8,57.85 42.8,66.15 42.5,66.45 | v46.1,50.65 U$5.2 50.95,50.6 U$6.2 51.2,50.65 v55.7,50.65 63.98,50.65 v66.23,52.9 | R116.1 v40.2,66.45
  other vias: 51.05,50.5 45.1,66.45
+5V  (via drill 0.3 pad 0.6)  (1 unrouted)
  Top 0.3: LED2.1-VDD 8.6,66 | 93.5,38.52 93.51,38.51 D2.C | LED5.1-VDD v8.85,54.35 | LED3.1-VDD v8.85,60.25
  Top 0.5: U2.4 U2.5 90.5,54.1 L1.1 C13.1 v82.1,54.1 72.9,54.1 v69.4,50.6 | K100.2 98.2,31 98.2,35.6 95.5,38.3 93.72,38.3 93.51,38.51 | v93.5,41.6 C20.1 93.5,38.52
  Top 1: C19.1 5.75,48.45 LED6.1-VDD
  Bottom 0.3: 8.75,47.6 8.75,48.35 LED6.1-VDD | 8.75,61.4 8.85,61.3 v8.85,60.25 8.75,60.15 | C105.1 8.93,64.5 | 8.93,64.5 8.8,64.63 | LED2.1-VDD 8.93,65.97 8.93,64.5
  Bottom 0.5: SJ100.1 v82.1,54.1 82.1,45.7 83.2,44.6 90.5,44.6 v93.5,41.6 | v69.4,50.6 67,50.6 63.9,47.5 28.98,47.5
  Bottom 1: IC1.5V 28.98,46.38 28.98,47.5 28.98,50.2 C101.+ 28.15,50.27 U$105.V+ 8.92,54.53 8.75,54.7 | LED1.1-VDD 8.8,72 8.8,64.63 | 8.8,64.63 8.8,62.33 | 8.75,54.7 8.75,60.15 8.75,61.4 8.75,64.58 8.8,64.63 | 8.75,54.7 8.75,47.6 8.75,42.65 LED14.1-VDD
  other vias: 8.75,72.05 8.85,42.55 8.85,48.45 8.75,66.15
+10V  (via drill 0.3 pad 0.6)
  Top 0.5: C14.1 94.4,49.55 94.25,49.4 D1.C 96.8,49.4 97.95,50.55 R25.1 C12.2 97.95,55.85 v97.9,55.9
  Bottom 0.5: IC100.1 95.65,57.45 95.65,56.95 95.5,56.95 | v97.9,55.9 97.5,56.3 96.15,56.3 95.5,56.95 | 90.9,56.35 86.55,56.35 86.15,56.75 IC102.1 84.9,57.35 C104.2 84.65,57.1 SJ100.2 | 90.9,56.35 93.7,56.35 C103.2 95.5,56.95 | IC101.1 90.95,56.4 90.9,56.35
A1  (via drill 0.3 pad 0.6)
  Top 0.3: v40.5,57.3 40.8,57.3 41.9,56.2 45.4,56.2 K102.P$4 46.45,55.35 R15.1 47.95,55 v48.4,55 | v58.4,53.5 58.95,52.95 R24.1
  Top 0.5: R19.2 45.5,54.75 K102.P$4
  Bottom 0.3: K103.1 30.7,59.55 30.7,58.5 31.9,57.3 v40.5,57.3 | v48.4,55 49.8,53.6 58.3,53.6 v58.4,53.5
A2  (via drill 0.3 pad 0.6)
  Top 0.3: U1.6 48.1,62.13 v48.1,60.7 48,60.7 47.35,60.05 41.53,60.05 41.15,59.67 41.15,58.65 v41.2,58.6 | v37.7,58.6 37.46,58.6 37.36,58.5 33.75,58.5 K103.2 | R20.2 50.3,56.1 K102.P$3 51.05,56.3 52,55.35 R16.1 53.4,54.45 53.4,53.05 R23.1
  Bottom 0.3: K102.P$3 48.1,58.7 v48.1,60.7 | v37.7,58.6 v41.2,58.6
A3  (via drill 0.3 pad 0.6)
  Top 0.3: U1.7 49.43,59.56 49.6,59.4 | v38.4,59.4 37.31,59.4 36.91,59 35.25,59 K103.3 | K102.P$2 55.5,57.9 54,59.4 49.6,59.4 | 49.6,59.4 v46.4,59.4 v41.8,59.4 | R22.1 48.8,52.8 v48.85,52.84 | R21.2 K102.P$2 | K102.P$2 55.8,56.3 56.7,55.4 57.55,55.4 R17.1
  Bottom 0.3: v38.4,59.4 v41.8,59.4 | v46.4,59.4 46.5,59.3 46.5,58.5 47.5,57.5 47.5,54.6 48.85,53.25 v48.85,52.84
A4  (via drill 0.3 pad 0.6)
  Top 0.3: v35,64.5 34.95,64.45 R11.1 33.45,62.3 29,62.3 28.2,61.5 28.2,58 30.1,56.1 K103.5
  Bottom 0.25: R114.1 36.1,65.45 R117.2
  Bottom 0.3: R117.2 34.4,65.1 v35,64.5
A5  (via drill 0.3 pad 0.6)
  Top 0.3: v40.1,64.5 40.05,64.45 R12.1 39.9,63.65 39.9,58.4 39.3,57.8 33.85,57.8 K103.6
  Bottom 0.3: R113.1 40.1,63.55 v40.1,64.5 40.3,64.7 R116.2
A6  (via drill 0.3 pad 0.6)
  Top 0.3: v14.9,71.9 13.8,71.9 LED1.4-DIN | v45.1,64.5 44.95,64.35 R13.1 43.75,62.6 42.4,62.6 40.4,60.6 40.4,58.19 39.51,57.3 35.35,57.3 K103.7
  Bottom 0.3: v14.9,71.9 14.6,71.6 14.6,64 21.8,56.8 25.7,56.8 27.6,54.9 32.95,54.9 K103.7 | R115.2 v45.1,64.5 R112.1
AIN_1
  Top 0.3: IC1.36 56.56,48.2 | 56.56,48.2 U$7.3 57.35,48.85 C18.1 | R24.2 56.7,52.15 56.7,48.34 56.56,48.2
AIN_2
  Top 0.3: R23.2 52,52.65 U$6.3 52.1,48.3 | 52.1,48.3 53.75,48.3 C17.1 | IC1.37 52.02,48.22 52.1,48.3
AIN_3
  Top 0.3: IC1.38 47.28,48.4 U$5.3 | U$5.3 49.05,48.4 C16.1 | U$5.3 47.1,52.55 R22.2
AIN_4
  Top 0.3: IC1.12 34.68,67.9 U$2.3 | U$2.3 33.45,67.25 C5.1 | R11.2 34.1,64.65 U$2.3
AIN_5/DO_2  (via drill 0.3 pad 0.6)
  Top 0.3: v92.8,57.9 v92.8,59.5 | C6.1 38.45,67.25 38.95,67.75 | 38.95,67.75 U$3.3 39.32,68.12 IC1.13 | 38.95,67.75 39.1,67.6 39.1,64.5 38.4,63.8 R12.2
  Bottom 0.3: IC101.3 92.8,57.4 v92.8,57.9 | v92.8,59.5 92.21,59.5 78.81,72.9 41.1,72.9 39.32,71.12 IC1.13
AIN_6/DO_3  (via drill 0.3 pad 0.6)
  Top 0.3: v88,58.2 88,58.44 v90.17,60.61 | U$4.3 44.1,64.5 43.4,63.8 R13.2 | U$4.3 43.96,67.9 IC1.15 | C7.1 42.35,67.9 U$4.3
  Bottom 0.3: IC102.3 88.05,58.15 v88,58.2 | v90.17,60.61 90.09,60.61 78.36,72.35 44.11,72.35 41.86,70.1 IC1.15
BAT+  (via drill 0.3 pad 0.6)
  Top 0.5: C11.BAT+ 56.4,60.5 56.8,60.9 56.8,60.8 C11.BAT+
  Bottom 0.5: C11.BAT+ 56.2,60.4 56.2,63.46 C107.BAT+
  other vias: 56.4,60.4
BAT-  (via drill 0.3 pad 0.6)
  Top 0.5: C11.BAT- 58.5,60.84 v58.5,60.9
  Bottom 0.5: v58.5,60.9 58.4,60.9 57,62.3 57,65.2 C107.BAT-
DALAS_TEMP  (via drill 0.3 pad 0.6)
  Top 0.3: K106.2 21.55,52.95 22.15,52.35 32.6,52.35 v36.7,48.25 36.7,46.28 IC1.26 | v89.7,59.1 93.1,62.5 IC103.2
  Top 0.5: K106.2 21.55,68.3 R3.1 19.3,68.4 U$1.3
  Bottom 0.3: v89.7,59.1 81.1,59.1 79.1,57.1 72.65,57.1 63.65,48.1 36.7,48.1 v36.7,48.25
DO_1  (via drill 0.3 pad 0.6)
  Top 0.3: U1.4 46.89,69.95 IC1.17 | v68.5,70.85 v76.6,70.85
  Bottom 0.3: IC100.3 97.65,57.95 96.8,58.8 91,58.8 78.95,70.85 v76.6,70.85 | IC1.17 46.94,70.04 48.25,71.35 68,71.35 v68.5,70.85
ENC  (via drill 0.3 pad 0.6)
  Top 0.3: C3.1 v69.9,69.35 R1.1
  Bottom 0.3: IC1.2 46.25,71.85 69.1,71.85 69.9,71.05 v69.9,69.35
ENC_2  (via drill 0.3 pad 0.6)
  Top 0.3: R2.2 R10.2 | R10.2 73,66 73.1,66 74.2,64.9 78.25,64.9 79.1,65.75 K105.2 79.4,65.55 81.35,65.55 82.2,64.7 87.4,64.7 v87.9,65.2 | R1.2 R9.1 R10.2
  Bottom 0.3: SJ101.2 87.9,65.4 v87.9,65.2
GND  (via drill 0.3 pad 0.6)
  Bottom 0.3: OK4.4 1.2,25.12 1.2,40.1
  other vias: 53.1,49.1 50.8,49.1 55.5,49 48.2,49.1 45.9,49.1 41.5,57.8 46.65,64.7 41.75,64.2 36.45,64.1 31.55,64.2 37.85,68.2 94.4,58.1 93.4,61.7 91.2,64.2 89.1,57.3 83,53.1 80.1,53.2 41.65,43.5 47.35,38.1 49.45,42 44.25,41.2 59.85,38 70.15,38.1 83.15,38.05 80.25,43.9 69.15,43.5 80.05,45.8 63.25,48.9 60.35,48.9 57.65,49.6 54.15,51.4 44.85,51.6 41.25,50.5 27.75,47.4 27.75,45.8 26.75,49.1 22.55,53.4 22.55,55.8 27.95,55.8 22.55,57.8 22.35,65 20.65,65 20.75,59 20.75,55.7 20.75,53.4 17.05,55.6 17.05,60.4 17.15,62.7 15.25,62 15.15,55.6 15.75,70.1 15.35,64.4 13.65,69.9 13.65,61.8 12.35,64.5 13.55,55.8 13.55,49.8 13.65,46.2 13.85,41.4 12.25,39.2 2.25,38.7 1.45,41.1 6.85,38.7 19.95,39.7 17.35,39.7 7.25,45.5 3.75,45.5 1.55,45.5 7.25,52.6 10.15,52.7 15.05,52.6 17.25,45.9 17.15,50.3 17.15,52.6 11.25,46.8 1.55,50.5 1.55,55.1 1.55,59.8 1.45,64.8 1.45,67.5 6.65,72.4 10.45,72.3 10.15,70.5 7.25,70.4 7.25,64.4 13.85,64.5 10.85,66.6 10.85,59.6 20.35,69.4 22.45,69.5 26.05,72.6 27.45,69.5 29.35,61.5 27.95,62.7 27.55,65 30.65,72.6 39.25,72.7 41.85,72 44.55,71.5 45.55,68.7 32.95,68.1 35.75,68 40.45,67.6 42.85,67.2 46.85,66.6 49.35,66.4 51.45,66.4 48.25,69 50.75,69 53.95,65.4 53.85,63.8 61.05,64.6 58.25,67.7 56.75,66.9 53.85,67.4 58.15,65.5 52.55,68.3 61.05,68.9 62.25,70.6 62.25,69.9 63.05,68.5 63.85,69 63.85,66.2 65.45,67.4 65.25,63.3 62.95,61.4 64.15,62.4 58.05,64.4 50.25,60.9 54.15,61.3 51.35,64.4 48.75,63.5 46.75,60.8 43.65,60.9 41.75,60.8 33.65,61.5 30.05,48.4 35.25,48.3 36.65,49.5 33.95,52.3 31.55,53.2 27.05,53.1 25.05,51.4 25.05,55.5 38.25,55.1 40.95,55 69.75,67.7 69.75,66 77.35,65.8 78.35,64 71.95,63.1 81.75,66.8 78.45,70.1 82.65,70.2 84.45,72.5 97.7,72.1 98.2,68.1 92.9,68.1 86.8,66.1 86.9,59.9 87.6,60.8 79.9,59.5 78.4,57.8 67.2,57.7 67.1,59.5 65.1,58.7 65.2,53.4 63.1,51.5 58.1,51.7 67.4,53.3 68.4,51.5 72.8,55.5 78.8,55.6 73.4,53 70.3,49.9 89.1,41.9 89.15,40.85 86.45,38.05 97.95,38.05 101.05,38.05 101.25,42.15 101.35,46.55 101.35,50.45 101.45,53.55 101.35,57.25 98.95,54.45 98.85,56.95 97.85,49.15 94.45,48.35 91.65,50.15 86.15,49.85 85.85,55.75 83.55,55.45 89.95,55.05 91.85,55.05 93.95,53.95 94.75,54.05 91.45,52.55 88.85,49.95 90.95,47.85 87.45,45.45 84.85,48.35 96.75,57.45 91.9,57.4 87.1,57.55 80.55,57.6 59.5,42.85 9.9,55.55 38.15,66.45 41.35,62.6 46.95,54 48.65,56.2 45.55,58.5 49.45,58.7 47.25,58.7 54.45,57.8 54.15,54.3 51.65,54.3 56.55,54.3 56.55,58.2 49.25,51.6 22.35,45.5 15.05,39.7 7.45,41.5 10.25,41.5 13.65,58.3 23.25,53.4 22.55,61.6 20.75,61.6 18.55,58.8 19.25,60.7 27.25,59.9 32.45,58.3 29.75,58.6 29.15,53.2 64.85,47.2 64.55,45.5 60.05,45.5 70.6,53.3 72,51.7 70.7,59.6 70.6,57.7 84.75,68.1 91.45,72.6 93.5,63.5 98,64.9 83,50.1 78.1,43.9 74.8,45.7 95,41.3 94.9,39.5 83.2,40.6 65.45,47.8 72.35,43.5 83.45,57.85 81.75,44.6 90.75,43.1 92.55,44.9 86.95,43.85 76,57.8 75.8,56.3 60.55,61.4 19.05,71 26.05,71.6 28.85,66.4
  pour Bottom: -0.7,38.4 20.3,38.4 23.1,41.2 23.1,44.1 23.9,44.9 40,44.9 47.2,37.7 104,37.7 105.8,39.5 105.8,78.8 -3.6,78.8 -8.5,73.9 -8.5,46.2
  pour Top: -2.4,38.4 20.3,38.4 23.1,41.2 23.1,44.1 23.8,44.8 40.1,44.8 47.2,37.7 104,37.7 105.7,39.4 105.7,78.7 101.3,83.1 -0.6,83.1 -9.6,74.1 -9.6,45.6
L_FUSED  (via drill 0.35)
  Top 0.35: v47.9,23.5 v47.9,24.5 48,24.5
  other vias: 44.9,20.5 44.9,21.5 44.9,22.5 44.9,23.5 44.9,24.5 45.9,20.5 45.9,21.5 45.9,22.5 45.9,23.5 45.9,24.5 46.9,24.5 46.9,23.5 46.9,22.5 46.9,21.5 46.9,20.5 47.9,22.5 47.9,21.5 47.9,20.5 48.9,24.5 48.9,23.5 48.9,22.5 48.9,21.5 48.9,20.5 49.9,24.5 49.9,23.5 49.9,22.5 49.9,21.5 49.9,20.5 44.7,32.4 74.48,27.2 74.48,26.2 75.38,26.2 76.38,26.2 77.38,26.2 75.38,27.2 76.38,27.2 77.38,27.2 78.38,27.2 79.38,27.2 79.38,26.2 78.38,26.2 74.48,25.2 75.38,25.2 76.38,25.2 77.38,25.2 78.38,25.2 79.38,25.2 81.18,22 58.8,21.6 59.9,21.6 65.4,20.2 41.8,35.1 39.2,37.5 36.5,39.9 36.2,29.6 39.1,27.7 39.2,25.7 39.2,23.7 39.2,21.7 36.4,37.1 36.3,33.9 39.1,33.8 39.1,31 41.8,31.1 49.8,31.8 52.1,26.6 52.1,21 49.8,18.4 42.7,18.4 41.5,25.7 44.1,28 45.6,28 47.1,28 44.1,26.4 45.6,26.4 47.1,26.4 57.5,25.1 59.9,25.1 59.9,24 59.9,22.8 58.8,24 58.8,25.1 58.8,22.8 58.8,20.4 59.9,20.4 59.9,19.2 58.8,19.2 57.6,19.2 57.6,20.4 57.5,21.6 57.5,22.8 57.5,24 69.1,24.6 67.3,24.6 65.4,24.6 65.4,26.1 65.4,23.2 65.4,21.7 66.5,18.4 72,18.4 72.8,19.1 72,19.8 71.1,20.6 70.3,21.4 76.38,23.2 77.38,23.2 78.38,23.2 79.38,23.2 79.38,24.2 78.38,24.2 77.38,24.2 76.38,24.2 75.38,24.2 81.18,27.2 69,18.4 34.6,37.1 32.6,37.1 32.5,39 34.6,39 34.6,33.9 32.6,33.9 32.6,35.5 34.5,35.5
  pour Top (no thermals): 36.7,41.4 45.8,32.3 81.6,32.3 81.6,17.9 42.4,17.9 31.6,28.7 31.6,41.4
  pour Bottom (no thermals): 31.6,28.7 31.6,41.4 36.7,41.4 45.8,32.3 81.6,32.3 81.6,17.9 42.4,17.9
L_IN  (via drill 0.3 pad 0.6)
  Top 0.3: v26.6,11.7 v27.2,12.3 27.2,14.6 P1.P$1 | F100.O_2 31.5,16.3 v30.3,17.5 v29.6,17.5
  Top 0.5: v27.2,12.3 v27.8,12.9 27.9,12.9 v29,14 29.1,14 v30.3,15.2 v31.9,15.2 | v30.3,17.5 v31,17.5 v31.7,17.5 | v22.9,11 23.7,10.2
  Top 1: U$105.AC/L 27.47,29.13 29.8,26.8 33.1,26.8 F100.O_1 | P1.P$1 27.65,14.15
  Top 3: U$104.P$3 23.7,10.2 27.65,14.15 29.9,16.4 34.1,16.4 34,16.3 F100.O_2
  Bottom 1: P1.P$1 26.3,15.1 27.48,13.92
  Bottom 3: 23.6,8.6 23.6,10.05 26.75,13.2 | 26.75,13.2 27.48,13.92 32.6,19.05 32.6,19.5 33.6,18.5 F100.O_2 30.5,13.2 26.75,13.2
L_OUT_1  (via drill 0.35)  (2 unrouted)
  Top 1: U$9.1 44.63,13.82 v44.6,13.79
  Top 2.5: U$103.P$3 45.5,8.8 45.5,13.26 U$9.1
  Bottom 0.3: v44.6,12.99 44.71,13.1 45.5,13.1 | R100.2 45.9,14.36 45.17,14.36 v44.6,13.79
  Bottom 1: v44.6,12.99 v44.6,13.79 v44.6,14.59 v45.3,14.59 45.53,14.36 45.9,14.36
  Bottom 2.5: U$103.P$3 45.5,8.8 45.5,13.1
  other vias: 45.3,12.99 45.3,13.79
L_OUT_2  (via drill 0.35)  (5 unrouted)
  Top 0.3: U$8.1 59.57,14.03 v59.3,14.3
  Top 1.5: U$102.P$3 62.85,8.55 62.85,9.24 59.6,12.49
  Bottom 0.3: v59.3,14.3 v59.3,13.6
  Bottom 1: R101.2 60.1,14.5 59.4,15.2
  Bottom 2.5: 59.4,12.95 59.74,12.95 62.9,9.79 U$102.P$3
  Bottom 2.54: 59.4,12.9 59.4,12.95 59.4,15.2
  other vias: 59.3,12.9 60,14.3 60,13.6 60,12.9
L_OUT_3  (via drill 0.35)  (1 unrouted)
  Top 0.3: 74.33,13.03 v74.1,12.8 | v74.1,13.5 U$10.1 74.1,13.97 v74.1,14.3
  Top 0.5: v74.8,13.5 74.57,13.5 U$10.1 74.8,13.27 v74.8,12.8 v74.8,14.3
  Bottom 0.3: v74.1,14.3 v74.1,13.5
  Bottom 0.35: R102.2
  Bottom 0.5: R102.2 76.26,13.54 76.29,13.5
  Bottom 2.5: U$101.P$3 79.95,8.55 79.95,9.84 76.29,13.5 v74.1,13.5
N
  Bottom 1: 20.62,15.48 20.62,25.58 17.1,29.1 11.22,29.1 U$105.AC/N | U$104.P$2 18.7,13.76 20.42,15.48 20.62,15.48 | R37.2 21.95,15.48 20.62,15.48
  pour Top (no thermals): 16.6,9.7 16.6,0.1 76.7,0.1 76.7,9.7
N$1
  Top 1: D3.A 15.25,19.29 14.22,20.32 OK4.2
  Bottom 0.5: D100.A 11.01,20.39 OK4.2
N$2
  Top 1: R36.1 19.78,23.12 23.61,19.29 D3.C
N$3
  Top 0.3: EN1.A 74.45,69.35 R2.1
N$4
  Top 1: OK4.1 11.83,17.78 R37.1
  Bottom 0.5: D100.C 9.06,17.78 OK4.1
N$5
  Bottom 0.5: OK3.6 80.08,32.24 R105.2
N$6  (via drill 0.3 pad 0.6, 0.35)
  Top 0.5: U$10.3 79.6,13.93 79.6,14.5 v80,14.9 v80.01,14.91 v80.01,15.61
  Bottom 0.35: R102.1 79.3,17.26
  Bottom 0.5: OK3.4 71.86,23.94 75.59,20.21 77.99,20.21 79.31,18.89 79.31,16.85 | 79.31,16.85 79.31,16.49 80,15.8 v80,14.9 v80,15.61 v80.01,15.61 | R102.1 79.31,16.85
N$7
  Bottom 0.3: 68.02,28.94 R103.2
  Bottom 0.5: OK2.6 68.1,31.99 68.1,28.86 R103.2
N$8
  Bottom 0.3: OK3.1 76.85,39.95 R108.2
N$9  (via drill 0.3 pad 0.6)
  Top 1: U$8.3 v64.85,13.84 v64.86,13.85 v64.86,14.5
  Bottom 0.5: OK2.4 62.77,18.43 64.86,16.34 v64.86,14.5 v64.86,13.85
  Bottom 1: v64.86,14.5 R101.1
N$10
  Bottom 0.3: OK2.1 67.73,39.98 R107.2
N$11
  Bottom 0.5: R104.2 58.76,31.85 OK1.6
N$12  (via drill 0.3 pad 0.6)  (1 unrouted)
  Top 0.3: v50.3,14.9 50.3,14.5 50.3,14.11 50.14,13.96 50.04,13.86
  Top 0.5: 50.04,13.86 U$9.3 50.01,14.21 50.3,14.5 | v50.3,14.3 50.3,14.2 50.34,14.15 50.14,13.96
  Bottom 0.3: v50.29,14.9 v50.3,14.9
  Bottom 0.5: OK1.4 53.3,32.23 53.3,29.04 54.67,27.67 54.67,19.27 50.35,14.95 | 50.35,14.95 49.96,14.56 | 49.56,14.36 R100.1 | 50.35,14.95 50.35,14.65 50.3,14.6 v50.3,14.3
N$13
  Bottom 0.3: R106.2 58.36,42.54 OK1.1
N$14
  Top 0.3: EN1.B 74.4,63.65 73.7,64.35 R10.1
N$15
  Bottom 0.3: SJ101.1 89.8,63.9 EN1.2
N$16
  Top 0.3: R30.2 54.5,42.7 LED10.A
N$17
  Top 0.3: R31.2 64.05,42.7 LED11.A
N$18
  Top 0.3: LED12.A 73.25,42.7 R32.2
N$19
  Top 0.3: LED2.4-DIN 12.65,66.15 10.05,68.75 LED1.2-DOUT
N$20
  Top 0.3: 87.4,39.4 Q1.3
  Top 0.5: K100.5 86.3,36.3 87.4,37.4 87.4,38.1 | 87.4,39.4 87.4,38.1 | D2.A 90.33,38.1 87.4,38.1
N$21
  Top 0.3: LED13.A 81.75,42.7 R33.2
N$22
  Top 0.3: LED4.A 79.6,56.65 R14.2
N$23
  Bottom 0.5: R110.1 90.95,54.47 IC101.5
N$24
  Top 0.5: L1.2 90.5,51.3 U2.1 90.33,51.12 D1.A
N$25
  Top 0.3: LED3.4-DIN 12.85,60.25 10.2,62.9 8.8,62.9 LED2.2-DOUT
N$26
  Top 0.3: LED5.4-DIN 12.55,54.35 9.9,57 8.8,57 LED3.2-DOUT
N$27
  Top 0.3: LED6.4-DIN 12.55,48.45 9.9,51.1 8.8,51.1 LED5.2-DOUT
N$28
  Top 0.3: LED14.4-DIN 12.75,42.55 10.15,45.15 LED6.2-DOUT
N$29
  Top 0.3: LED9.A 95.8,44.95 R28.2
N$30
  Top 0.3: R27.2 90.25,43.9 LED8.A
N$31
  Bottom 0.5: R109.1 97.92,52.6 96.83,53.69 96.83,54.09 96.27,54.65 IC100.5
N$32
  Top 0.3: R26.2 85.25,43.9 LED7.A
N$33
  Bottom 0.5: IC102.5 86.2,54.6 86.2,53.82 R111.1
N$34
  Top 0.3: U2.3 92.6,51.5 92.6,52.4 92.9,52.7 95.85,52.7 C12.1 | C12.1 R25.2 | R18.2 96.7,53.55 C12.1
N$38
  Top 0.3: U1.1 51.95,67.8 R5.1
OUT_1_SIG  (via drill 0.3 pad 0.6)
  Top 0.3: R30.1 56.6,42.9 R106.1
  Bottom 0.3: IC1.25 39.9,46.2 44,42.1 48.4,42.1 49.1,42.8 56.4,42.8 R106.1
  other vias: 56.6,42.6
OUT_2_SIG  (via drill 0.3 pad 0.6)
  Top 0.3: R31.1 66.05,42.76 R107.1
  Bottom 0.3: IC1.32 44.4,44.2 45.5,43.1 48.07,43.1 48.67,43.7 65.07,43.7 R107.1
  other vias: 66.03,42.74
OUT_3_SIG  (via drill 0.3 pad 0.6)
  Top 0.3: v43.7,43.6 43.85,43.75 v47.8,43.75 | R32.1 75.25,42.92 R108.1
  Bottom 0.3: R108.1 73.77,44.2 48.25,44.2 v47.8,43.75 | IC1.33 41.86,45.44 v43.7,43.6
  other vias: 75.15,42.82
PE
  pour Bottom (no thermals): -0.3,10.3 14.4,10.3 15.3,9.4 15.3,6.4 16.5,5.2 31.3,5.2 34.5,8.4 34.5,9.7 37.2,9.7 37.2,7.3 39.4,5.1 48.3,5.1 51.6,8.4 51.6,9.7 54.3,9.7 54.3,7 56.2,5.1 65.5,5.1 68.7,8.3 68.7,9.7 71.3,9.7 71.3,7.2 73.8,4.7 103.9,4.7 103.9,0.2 103.3,-0.4 0.8,-0.4 -0.3,0.7
PWM_1
  Top 0.5: R28.1 96.25,46.6 K101.P$2
  Bottom 0.5: K101.P$2 95.38,47.98 R109.2
PWM_2
  Top 0.5: R27.1 91.25,46.6 K101.P$3
  Bottom 0.5: K101.P$3 89,46.7 89.98,47.68 R110.2
PWM_3
  Top 0.5: R26.1 86.25,46.6 K101.P$4
  Bottom 0.5: K101.P$4 84,52.02 R111.2
R_C
  Top 3: U$100.P$2 92.2,32.8 K100.1
  Bottom 3: K100.1 92.2,32.8 U$100.P$2
R_NC
  Top 3: K100.4 87.2,17.8 U$100.P$1
  Bottom 3: U$100.P$1 87.2,17.8 K100.4
R_NO
  Top 3: K100.3 97.2,17.6 U$100.P$3
  Bottom 3: U$100.P$3 97.2,17.6 K100.3
RELAY_SIG  (via drill 0.3 pad 0.6)
  Top 0.3: v46.9,44.4 40.82,44.4 v40.8,44.38 | 84.3,42 v84.2,41.9 | 84.3,42 R34.1 85.55,41 Q1.1 | R33.1 84.3,42
  Bottom 0.3: v46.9,44.4 47.3,44.8 80.5,44.8 83.4,41.9 v84.2,41.9 | v40.8,44.38 40.6,44.38 39.97,45 34.5,45 34.24,45.26 IC1.27
SCL
  Top 0.3: R4.1 C2.1 59.35,71.5 59.55,71.7 | IC1.22 51.18,71.7 59.55,71.7 | JP1.4 99.77,67.3 84.3,67.3 79.6,72 59.85,72 59.55,71.7
SCL_P
  Top 0.3: R7.1 62.8,67.1 63.5,67.8 | K104.2 63.95,68.25 63.5,67.8 | R4.2 63.5,67.8
SDA  (via drill 0.3 pad 0.6)
  Top 0.3: C9.1 R6.1 59.35,65.95 v59.6,66.2 58.6,66.2 56.6,68.2 53.82,68.2 IC1.21 | v63.2,69.8 64.9,71.5 79.39,71.5 84.09,66.8 97.4,66.8 99.97,64.23 JP1.3
  Bottom 0.3: v59.6,66.2 v63.2,69.8
SDA_P
  Top 0.3: K104.3 R8.1 64.9,66.05 64.25,65.4 61.9,65.4 61.6,65.7 R6.2
SENS_IN
  Top 1: U$104.P$4 32.5,12.3 35.66,12.3 38.1,14.74 38.1,18.06 33.53,22.63 26.5,22.63 R36.2
ZC
  Top 0.3: R35.2 16.18,40.8 | 16.18,40.8 R29.1 | OK4.5 3.26,20.52 2.3,20.52 1.2,21.62 1.2,39.4 2.5,40.7 16.08,40.7 16.18,40.8
ZC_SIG
  Top 0.3: R35.1 C21.1 20.6,38.9 22.9,41.2 22.9,44.1 23.8,45 40.11,45 40.13,45.02 45.71,45.02 45.73,45.05 45.79,45.05 IC1.39

### Text on the board
tStop: rev_1a | ESP32_unimodule | N
bStop: G IN 3V3 | TEMP | SCL | SDA | G 321 | 3V3 | A1 | A2 | A3 | GND | ENC | PWM OUT | 3V 456 | 2020 | github.com/cmeldas | Matous Cmelik | 3 | 2 | 1 | GND | PE | N | L | PE | N | L_1 | PE | N | L_2 | PE | N | L_3